# Altium project Satellite_4U_PEE_V100.PrjPcb (part 3 of 4)

## Sheet 09_eMMC.SchDoc
size 420 x 297 mm; SheetNumber: 18; SheetTotal: 33
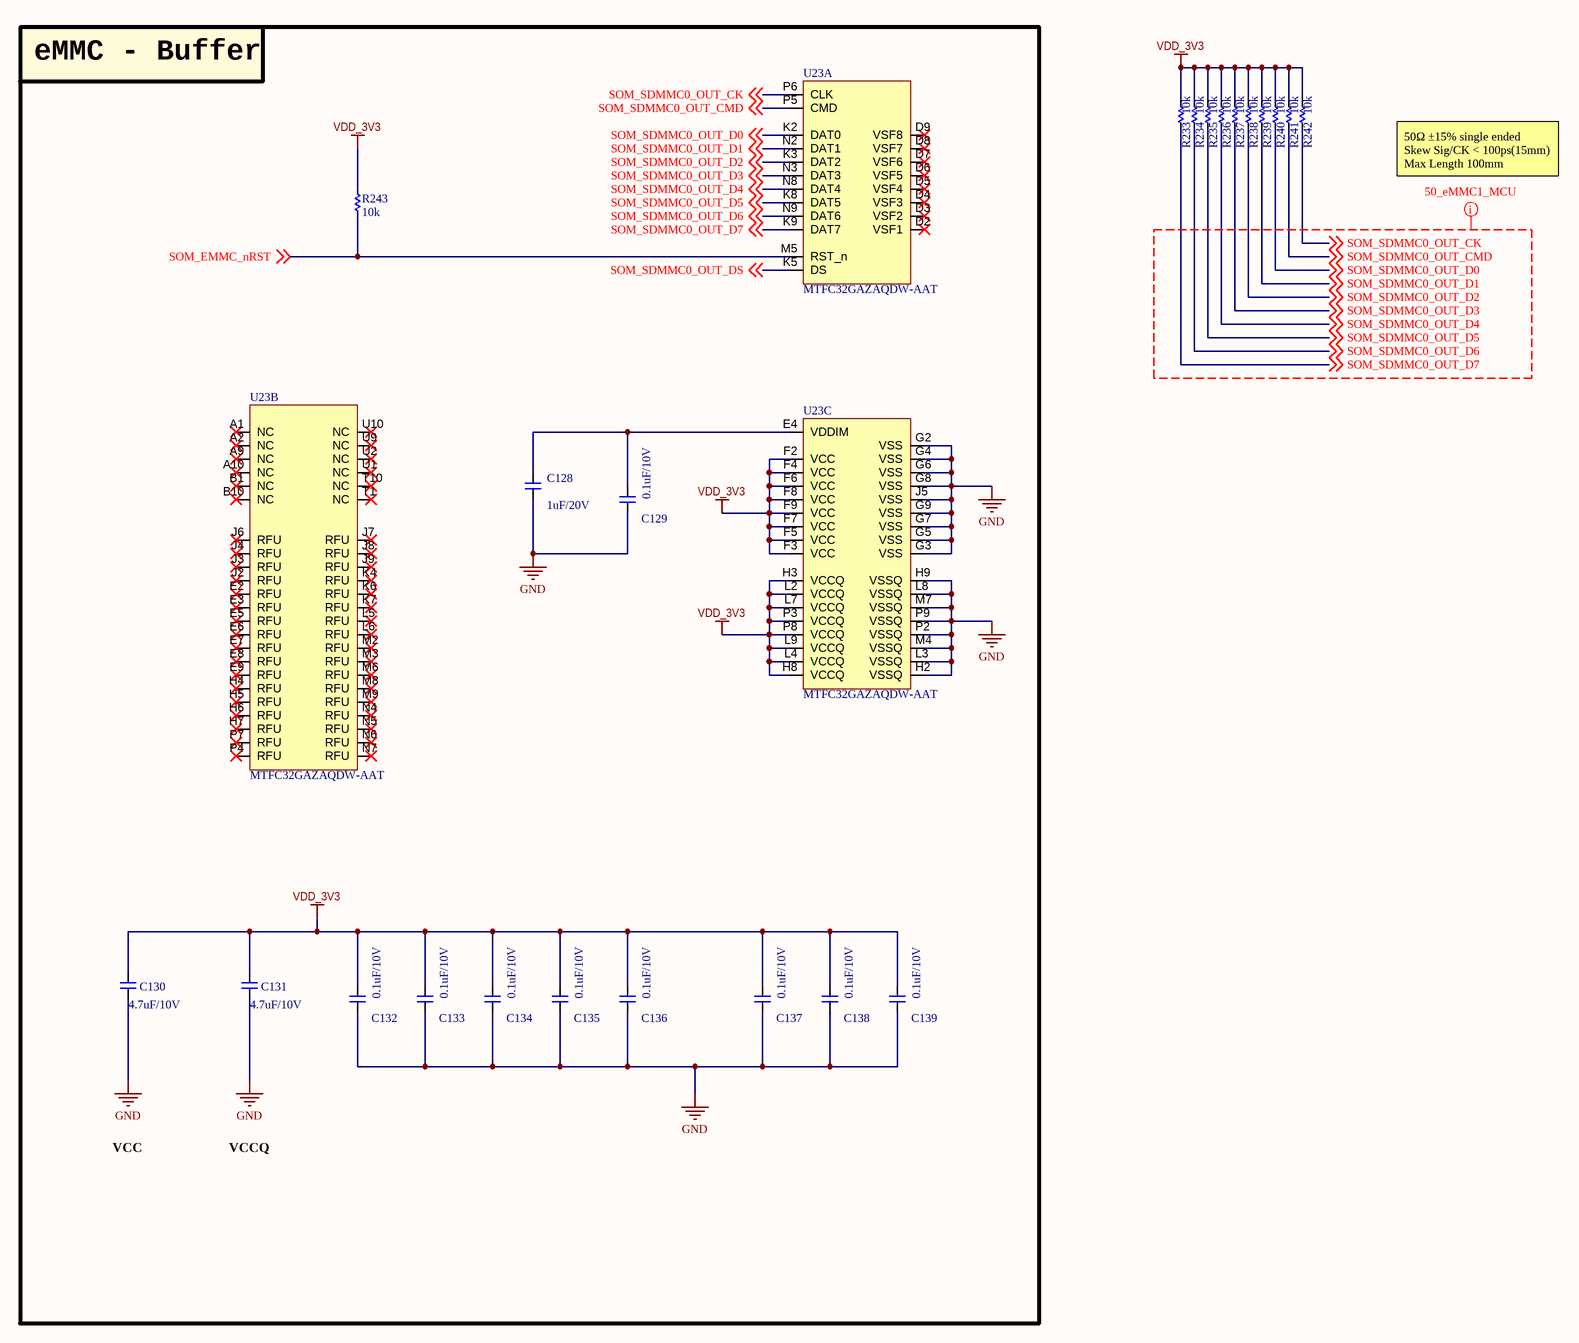
[diagram p19: 09_eMMC.SchDoc]

### Parts
(Parts that share a designator on the sheet are numbered #1, #2 ... from top to bottom, then left to right.)
C128  1uF/20V  [CAP_C_1005X50_L]
C129  0.1uF/10V  [CAP_C_1005X50_L]
C130  4.7uF/10V  [CAP_C_1005X50_L]
C131#2  4.7uF/10V  [CAP_C_1005X50_L]
C132#2  0.1uF/10V  [CAP_C_1005X50_L]
C133#2  0.1uF/10V  [CAP_C_1005X50_L]
C134#2  0.1uF/10V  [CAP_C_1005X50_L]
C135#2  0.1uF/10V  [CAP_C_1005X50_L]
C136#2  0.1uF/10V  [CAP_C_1005X50_L]
C137#2  0.1uF/10V  [CAP_C_1005X50_L]
C138#2  0.1uF/10V  [CAP_C_1005X50_L]
C139#2  0.1uF/10V  [CAP_C_1005X50_L]
R233  10k  [RES_C_1005x30_L]
R234  10k  [RES_C_1005x30_L]
R235  10k  [RES_C_1005x30_L]
R236  10k  [RES_C_1005x30_L]
R237  10k  [RES_C_1005x30_L]
R238  10k  [RES_C_1005x30_L]
R239  10k  [RES_C_1005x30_L]
R240  10k  [RES_C_1005x30_L]
R241  10k  [RES_C_1005x30_L]
R242  10k  [RES_C_1005x30_L]
R243  10k  [RES_C_1005x30_L]
U23#2  MTFC32GAZAQDW-AAT  [BGA_100_C_100P_10X17_1400X1800X150]  (parts A,B,C of 3)

### Blocks framed on the sheet
eMMC - Buffer: C128-C130 C131#2 C132#2 C133#2 C134#2 C135#2 C136#2 C137#2 C138#2 C139#2 R243 U23#2

### Nets
GND: C128.1 C129.1 C130.1 C131#2.1 C132#2.1 C133#2.1 C134#2.1 C135#2.1 C136#2.1 C137#2.1 C138#2.1 C139#2.1 U23#2.G2(VSS) U23#2.G3(VSS) U23#2.G4(VSS) U23#2.G5(VSS) U23#2.G6(VSS) U23#2.G7(VSS) U23#2.G8(VSS) U23#2.G9(VSS) U23#2.H2(VSSQ) U23#2.H9(VSSQ) U23#2.J5(VSS) U23#2.L3(VSSQ) U23#2.L8(VSSQ) U23#2.M4(VSSQ) U23#2.M7(VSSQ) U23#2.P2(VSSQ) U23#2.P9(VSSQ)
VDD_3V3: C130.2 C131#2.2 C132#2.2 C133#2.2 C134#2.2 C135#2.2 C136#2.2 C137#2.2 C138#2.2 C139#2.2 R233.2 R234.2 R235.2 R236.2 R237.2 R238.2 R239.2 R240.2 R241.2 R242.2 R243.2 U23#2.F2(VCC) U23#2.F3(VCC) U23#2.F4(VCC) U23#2.F5(VCC) U23#2.F6(VCC) U23#2.F7(VCC) U23#2.F8(VCC) U23#2.F9(VCC) U23#2.H3(VCCQ) U23#2.H8(VCCQ) U23#2.L2(VCCQ) U23#2.L4(VCCQ) U23#2.L7(VCCQ) U23#2.L9(VCCQ) U23#2.P3(VCCQ) U23#2.P8(VCCQ)
SOM_EMMC_nRST: R243.1 U23#2.M5(RST_n) ; off-sheet SOM_EMMC_nRST
SOM_SDMMC0_OUT_CK: R242.1 U23#2.P6(CLK) ; off-sheet SOM_SDMMC0_OUT_CK
SOM_SDMMC0_OUT_CMD: R241.1 U23#2.P5(CMD) ; off-sheet SOM_SDMMC0_OUT_CMD
SOM_SDMMC0_OUT_D0: R240.1 U23#2.K2(DAT0) ; off-sheet SOM_SDMMC0_OUT_D0
SOM_SDMMC0_OUT_D1: R239.1 U23#2.N2(DAT1) ; off-sheet SOM_SDMMC0_OUT_D1
SOM_SDMMC0_OUT_D2: R238.1 U23#2.K3(DAT2) ; off-sheet SOM_SDMMC0_OUT_D2
SOM_SDMMC0_OUT_D3: R237.1 U23#2.N3(DAT3) ; off-sheet SOM_SDMMC0_OUT_D3
SOM_SDMMC0_OUT_D4: R236.1 U23#2.N8(DAT4) ; off-sheet SOM_SDMMC0_OUT_D4
SOM_SDMMC0_OUT_D5: R235.1 U23#2.K8(DAT5) ; off-sheet SOM_SDMMC0_OUT_D5
SOM_SDMMC0_OUT_D6: R234.1 U23#2.N9(DAT6) ; off-sheet SOM_SDMMC0_OUT_D6
SOM_SDMMC0_OUT_D7: R233.1 U23#2.K9(DAT7) ; off-sheet SOM_SDMMC0_OUT_D7
SOM_SDMMC0_OUT_DS: U23#2.K5(DS) ; off-sheet SOM_SDMMC0_OUT_DS
NetC128_2: C128.2 C129.2 U23#2.E4(VDDIM)

Not connected (* = marked no-connect by the designer): U23#2 A1(NC)* A2(NC)* A9(NC)* A10(NC)* B1(NC)* B10(NC)* D2(VSF1)* D3(VSF2)* D4(VSF3)* D5(VSF4)* D6(VSF5)* D7(VSF6)* D8(VSF7)* D9(VSF8)* E2(RFU)* E3(RFU)* E5(RFU)* E6(RFU)* E7(RFU)* E8(RFU)* E9(RFU)* H4(RFU)* H5(RFU)* H6(RFU)* H7(RFU)* J2(RFU)* J3(RFU)* J4(RFU)* J6(RFU)* J7(RFU)* J8(RFU)* J9(RFU)* K4(RFU)* K6(RFU)* K7(RFU)* L5(RFU)* L6(RFU)* M2(RFU)* M3(RFU)* M6(RFU)* M8(RFU)* M9(RFU)* N4(RFU)* N5(RFU)* N6(RFU)* N7(RFU)* P4(RFU)* P7(RFU)* T1(NC)* T10(NC)* U1(NC)* U2(NC)* U9(NC)* U10(NC)*

### Layout directives
net class 50_eMMC1_MCU: SOM_SDMMC0_OUT_CK, SOM_SDMMC0_OUT_CMD, SOM_SDMMC0_OUT_D0, SOM_SDMMC0_OUT_D1, SOM_SDMMC0_OUT_D2, SOM_SDMMC0_OUT_D3, SOM_SDMMC0_OUT_D4, SOM_SDMMC0_OUT_D5, SOM_SDMMC0_OUT_D6, SOM_SDMMC0_OUT_D7

### Notes on the sheet
- 50Ω ±15% single ended
  Skew Sig/CK < 100ps(15mm)
  Max Length 100mm
- VCC
- VCCQ
- Project:
- BEE-1012
- Sub-system:
- SATELLITE_EXP_CONTROLLER
- Design by:
- SANG HUYNH
- BAO BUI
- Sheet title:
- Sheet
- A3
- of
- Checked by:
- Approved by:
- VU PHAM
- Revision:
- Document No:
- Size:
- Date:

### Library data of the parts
C128-C130 C131#2 C132#2 C133#2 C134#2 C135#2 C136#2 C137#2 C138#2 C139#2 = _CAP_C_2: CAP
R233-R243 = _RES_B_2: RES

## Sheet 10_USB.SchDoc
size 420 x 297 mm; SheetNumber: 19; SheetTotal: 33
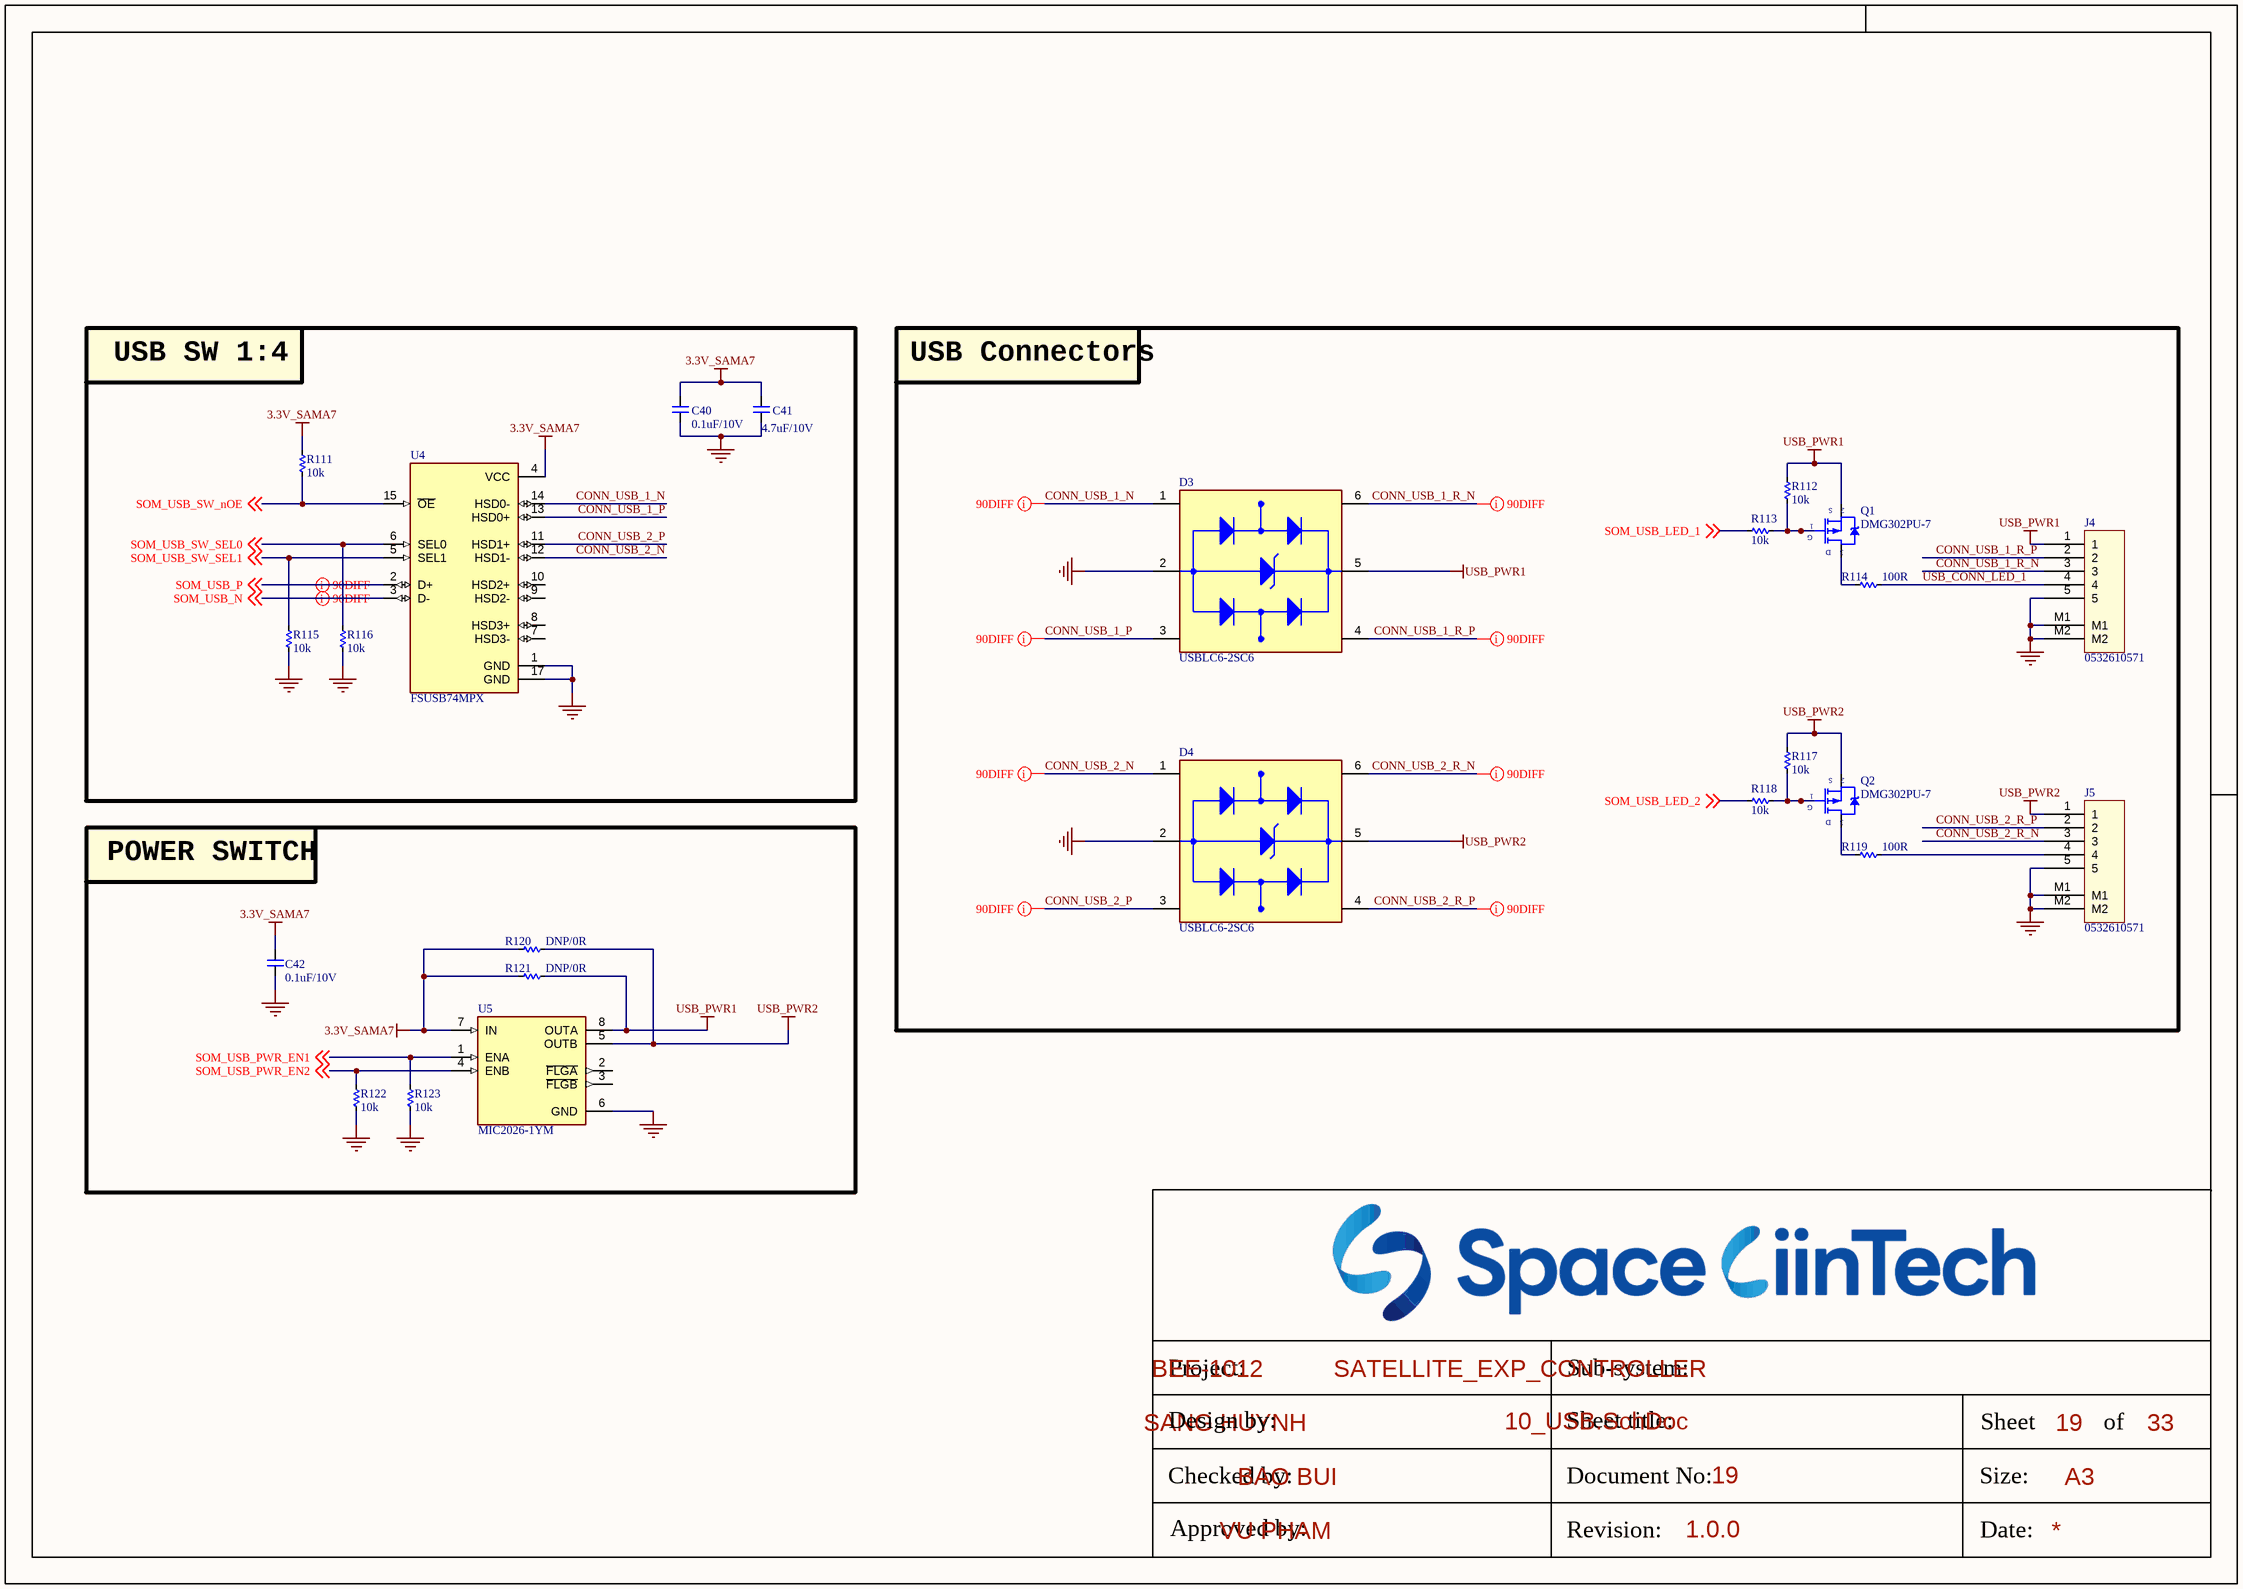
[diagram p20: 10_USB.SchDoc]

### Parts
C40  0.1uF/10V  [CAP_C_1005X50_L]
C41  4.7uF/10V  [CAP_C_1005X50_L]
C42  0.1uF/10V  [CAP_C_1005X50_L]
D3  USBLC6-2SC6  [SOT95P280X145-6N]
D4  USBLC6-2SC6  [SOT95P280X145-6N]
J4  0532610571  [MOLEX_0532610571]
J5  0532610571  [MOLEX_0532610571]
Q1  DMG302PU-7  [SOT95P240X120-3N]
Q2  DMG302PU-7  [SOT95P240X120-3N]
R111  10k  [RES_C_1005x30_L]
R112  10k  [RES_C_1005x30_L]
R113  10k  [RES_C_1005x30_L]
R114  100R  [RES_C_1005x30_L]
R115  10k  [RES_C_1005x30_L]
R116  10k  [RES_C_1005x30_L]
R117  10k  [RES_C_1005x30_L]
R118  10k  [RES_C_1005x30_L]
R119  100R  [RES_C_1005x30_L]
R120  DNP/0R  [RES_C_1005x30_L]
R121  DNP/0R  [RES_C_1005x30_L]
R122  10k  [RES_C_1005x30_L]
R123  10k  [RES_C_1005x30_L]
U4  FSUSB74MPX  [QFN50P300X300X80-17N]
U5  MIC2026-1YM  [SOIC127P602X173-8N]

### Blocks framed on the sheet
USB SW 1:4: C40 C41 R111 R115 R116 U4
USB Connectors: D3 D4 J4 J5 Q1 Q2 R112-R114 R117-R119
POWER SWITCH: C42 R120-R123 U5

### Nets
3.3V_SAMA7: C40.2 C41.2 C42.2 R111.1 R120.2 R121.2 U4.4(VCC) U5.7(IN)
GND: C40.1 C41.1 C42.1 D3.2(GND) D4.2(GND) J4.5 J4.M1 J4.M2 J5.5 J5.M1 J5.M2 R115.2 R116.2 R122.2 R123.2 U4.1(GND) U4.17(GND) U5.6(GND)
USB_PWR1: D3.5(VBUS) J4.1 Q1.2(S) R112.1 R121.1 U5.8(OUTA)
USB_PWR2: D4.5(VBUS) J5.1 Q2.2(S) R117.1 R120.1 U5.5(OUTB)
CONN_USB_1_N: D3.1(I/O1_IN) U4.14(HSD0-)
CONN_USB_1_P: D3.3(I/O2_IN) U4.13(HSD0+)
CONN_USB_1_R_N: D3.6(I/O1_OUT) J4.3
CONN_USB_1_R_P: D3.4(I/O2_OUT) J4.2
CONN_USB_2_N: D4.1(I/O1_IN) U4.12(HSD1-)
CONN_USB_2_P: D4.3(I/O2_IN) U4.11(HSD1+)
CONN_USB_2_R_N: D4.6(I/O1_OUT) J5.3
CONN_USB_2_R_P: D4.4(I/O2_OUT) J5.2
SOM_USB_LED_1: R113.1 ; off-sheet SOM_USB_LED_1
SOM_USB_LED_2: R118.1 ; off-sheet SOM_USB_LED_2
SOM_USB_N: U4.3(D-) ; off-sheet SOM_USB_N  [project net USBC_N]
SOM_USB_P: U4.2(D+) ; off-sheet SOM_USB_P  [project net USBC_P]
SOM_USB_PWR_EN1: R123.1 U5.1(ENA) ; off-sheet SOM_USB_PWR_EN1
SOM_USB_PWR_EN2: R122.1 U5.4(ENB) ; off-sheet SOM_USB_PWR_EN2
SOM_USB_SW_nOE: R111.2 U4.15(~{OE}) ; off-sheet SOM_USB_SW_nOE
SOM_USB_SW_SEL0: R116.1 U4.6(SEL0) ; off-sheet SOM_USB_SW_SEL0
SOM_USB_SW_SEL1: R115.1 U4.5(SEL1) ; off-sheet SOM_USB_SW_SEL1
USB_CONN_LED_1: J4.4 R114.2
NetJ5_4: J5.4 R119.2
NetQ1_1: Q1.1(G) R112.2 R113.2
NetQ1_3: Q1.3(D) R114.1
NetQ2_1: Q2.1(G) R117.2 R118.2
NetQ2_3: Q2.3(D) R119.1

Not connected (* = marked no-connect by the designer): U4 7(HSD3-) 8(HSD3+) 9(HSD2-) 10(HSD2+); U5 2(~{FLGA}) 3(~{FLGB})

### Layout directives
differential pair; differential pair class DIFF90: CONN_USB_1_N, CONN_USB_1_P, CONN_USB_1_R_N, CONN_USB_1_R_P, CONN_USB_2_N, CONN_USB_2_P, CONN_USB_2_R_N, CONN_USB_2_R_P, USBC_N, USBC_P

### Notes on the sheet
- Project:
- BEE-1012
- Sub-system:
- SATELLITE_EXP_CONTROLLER
- Design by:
- SANG HUYNH
- BAO BUI
- Sheet title:
- Sheet
- A3
- of
- Checked by:
- Approved by:
- VU PHAM
- Revision:
- Document No:
- Size:
- Date:

### Library data of the parts
C40-C42 = _CAP_C_2: CAP
D3 D4 = USBLC6-2SC6: 17V Clamp 5A (8/20Âµs) Ipp Tvs Diode Surface Mount SOT-23-6; MF: STMicroelectronics; Value: *; SnapEDA_Link: https://www.snapeda.com/parts/USBLC6-2SC6/STMicroelectronics/view-part/?ref=snap; Check_prices: https://www.snapeda.com/parts/USBLC6-2SC6/STMicroelectronics/view-part/?ref=eda; Purchase-URL: https://pricing.snapeda.com/search/part/USBLC6-2SC6/?ref=eda; Price: None; Availability: In Stock; Package: SOT-23-6 STMicroelectronics; MP: USBLC6-2SC6
J4 J5 = Header 5x1_2M
Q1 Q2 = MOSFET_P_GSD
R111-R123 = _RES_B_2: RES
U4 = IC_USB_SW_FSUSB74MPX: USB Switch IC 1 Channel 16-MLP (3x3); MF: ON Semiconductor; SnapEDA_Link: https://www.snapeda.com/parts/FSUSB74MPX/Onsemi/view-part/?ref=snap; Package: WQFN-16 ON Semiconductor; Value: *; MP: FSUSB74MPX; Check_prices: https://www.snapeda.com/parts/FSUSB74MPX/Onsemi/view-part/?ref=eda
U5 = IC_PWRSW_MIC2026-1YM: Power Switch/Driver 1:2 N-Channel 1.25A 8-SOIC; MF: Microchip; SnapEDA_Link: https://www.snapeda.com/parts/MIC2026-1YM/Microchip/view-part/?ref=snap; Package: SO-8 Microchip; Value: *; MP: MIC2026-1YM; Check_prices: https://www.snapeda.com/parts/MIC2026-1YM/Microchip/view-part/?ref=eda

## Sheet 11_MCU.SchDoc
size 420 x 297 mm; SheetNumber: 20; SheetTotal: 33
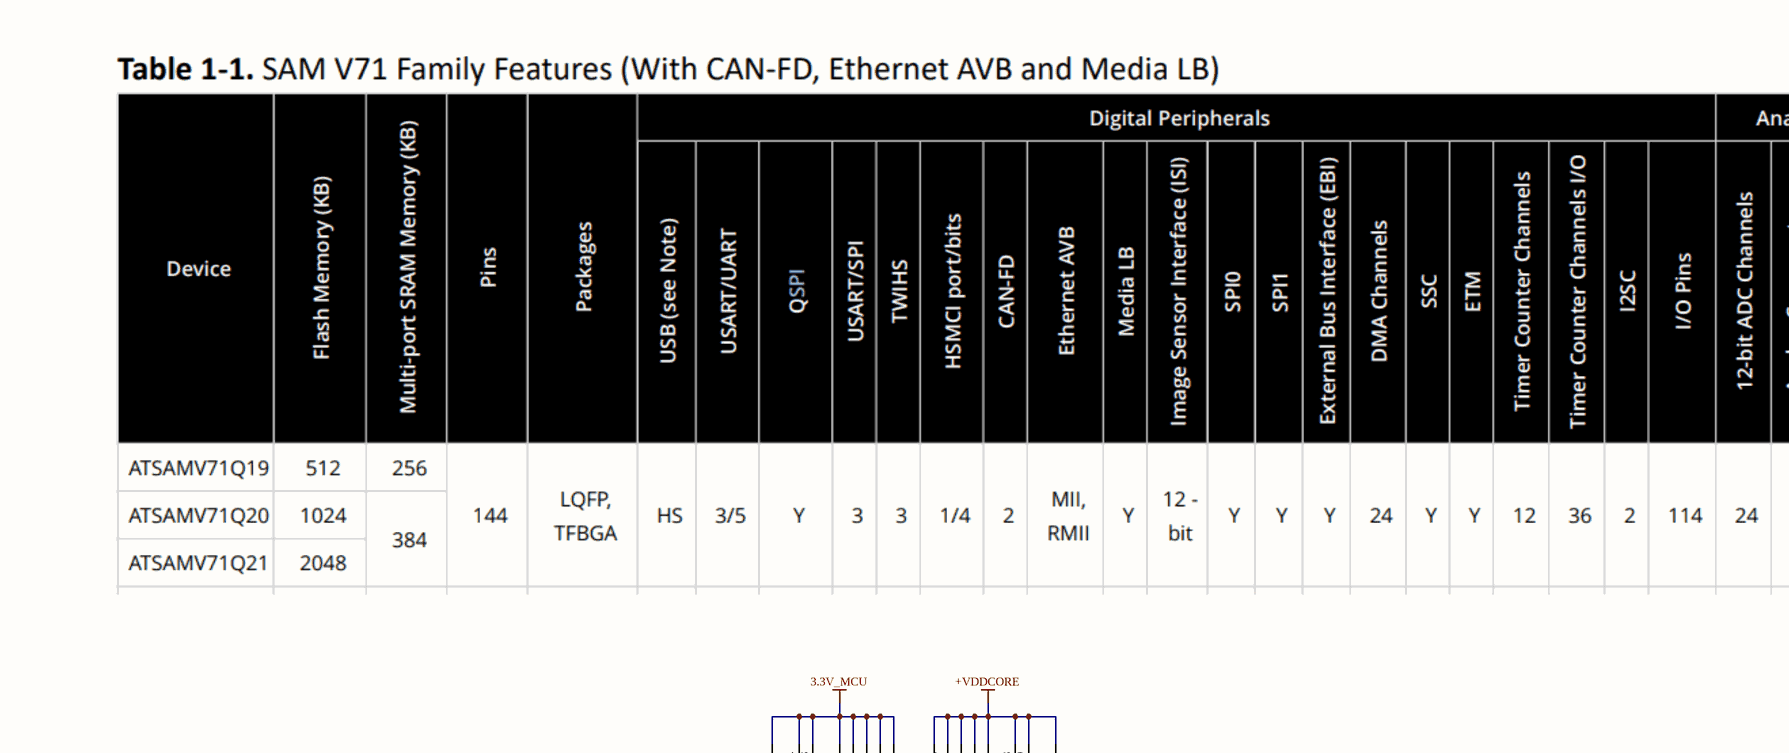
[diagram p21: 11_MCU.SchDoc, top left]
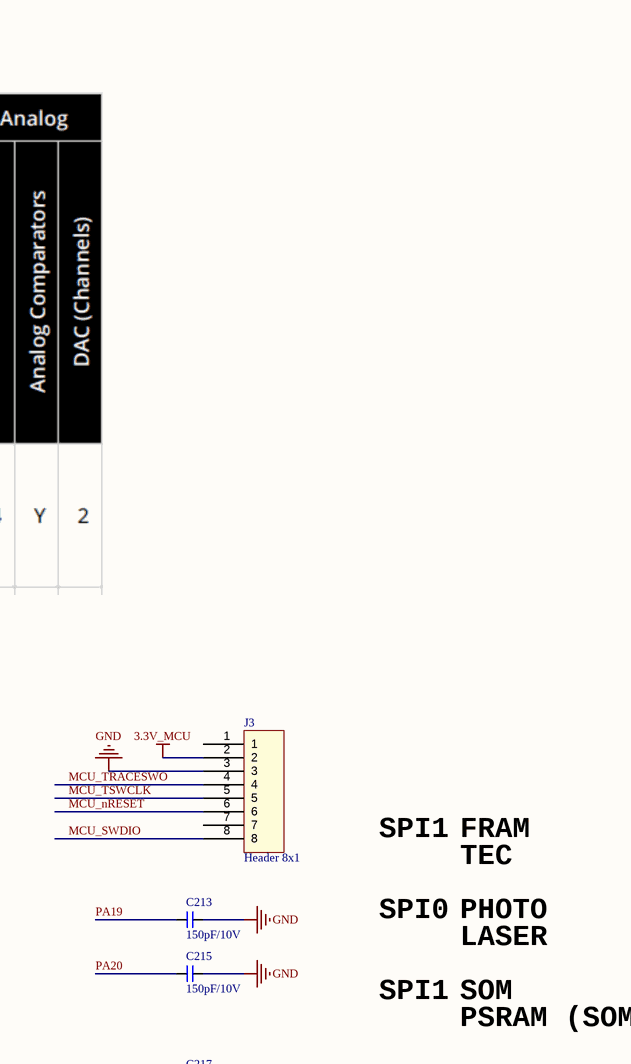
[diagram p22: 11_MCU.SchDoc, top right]
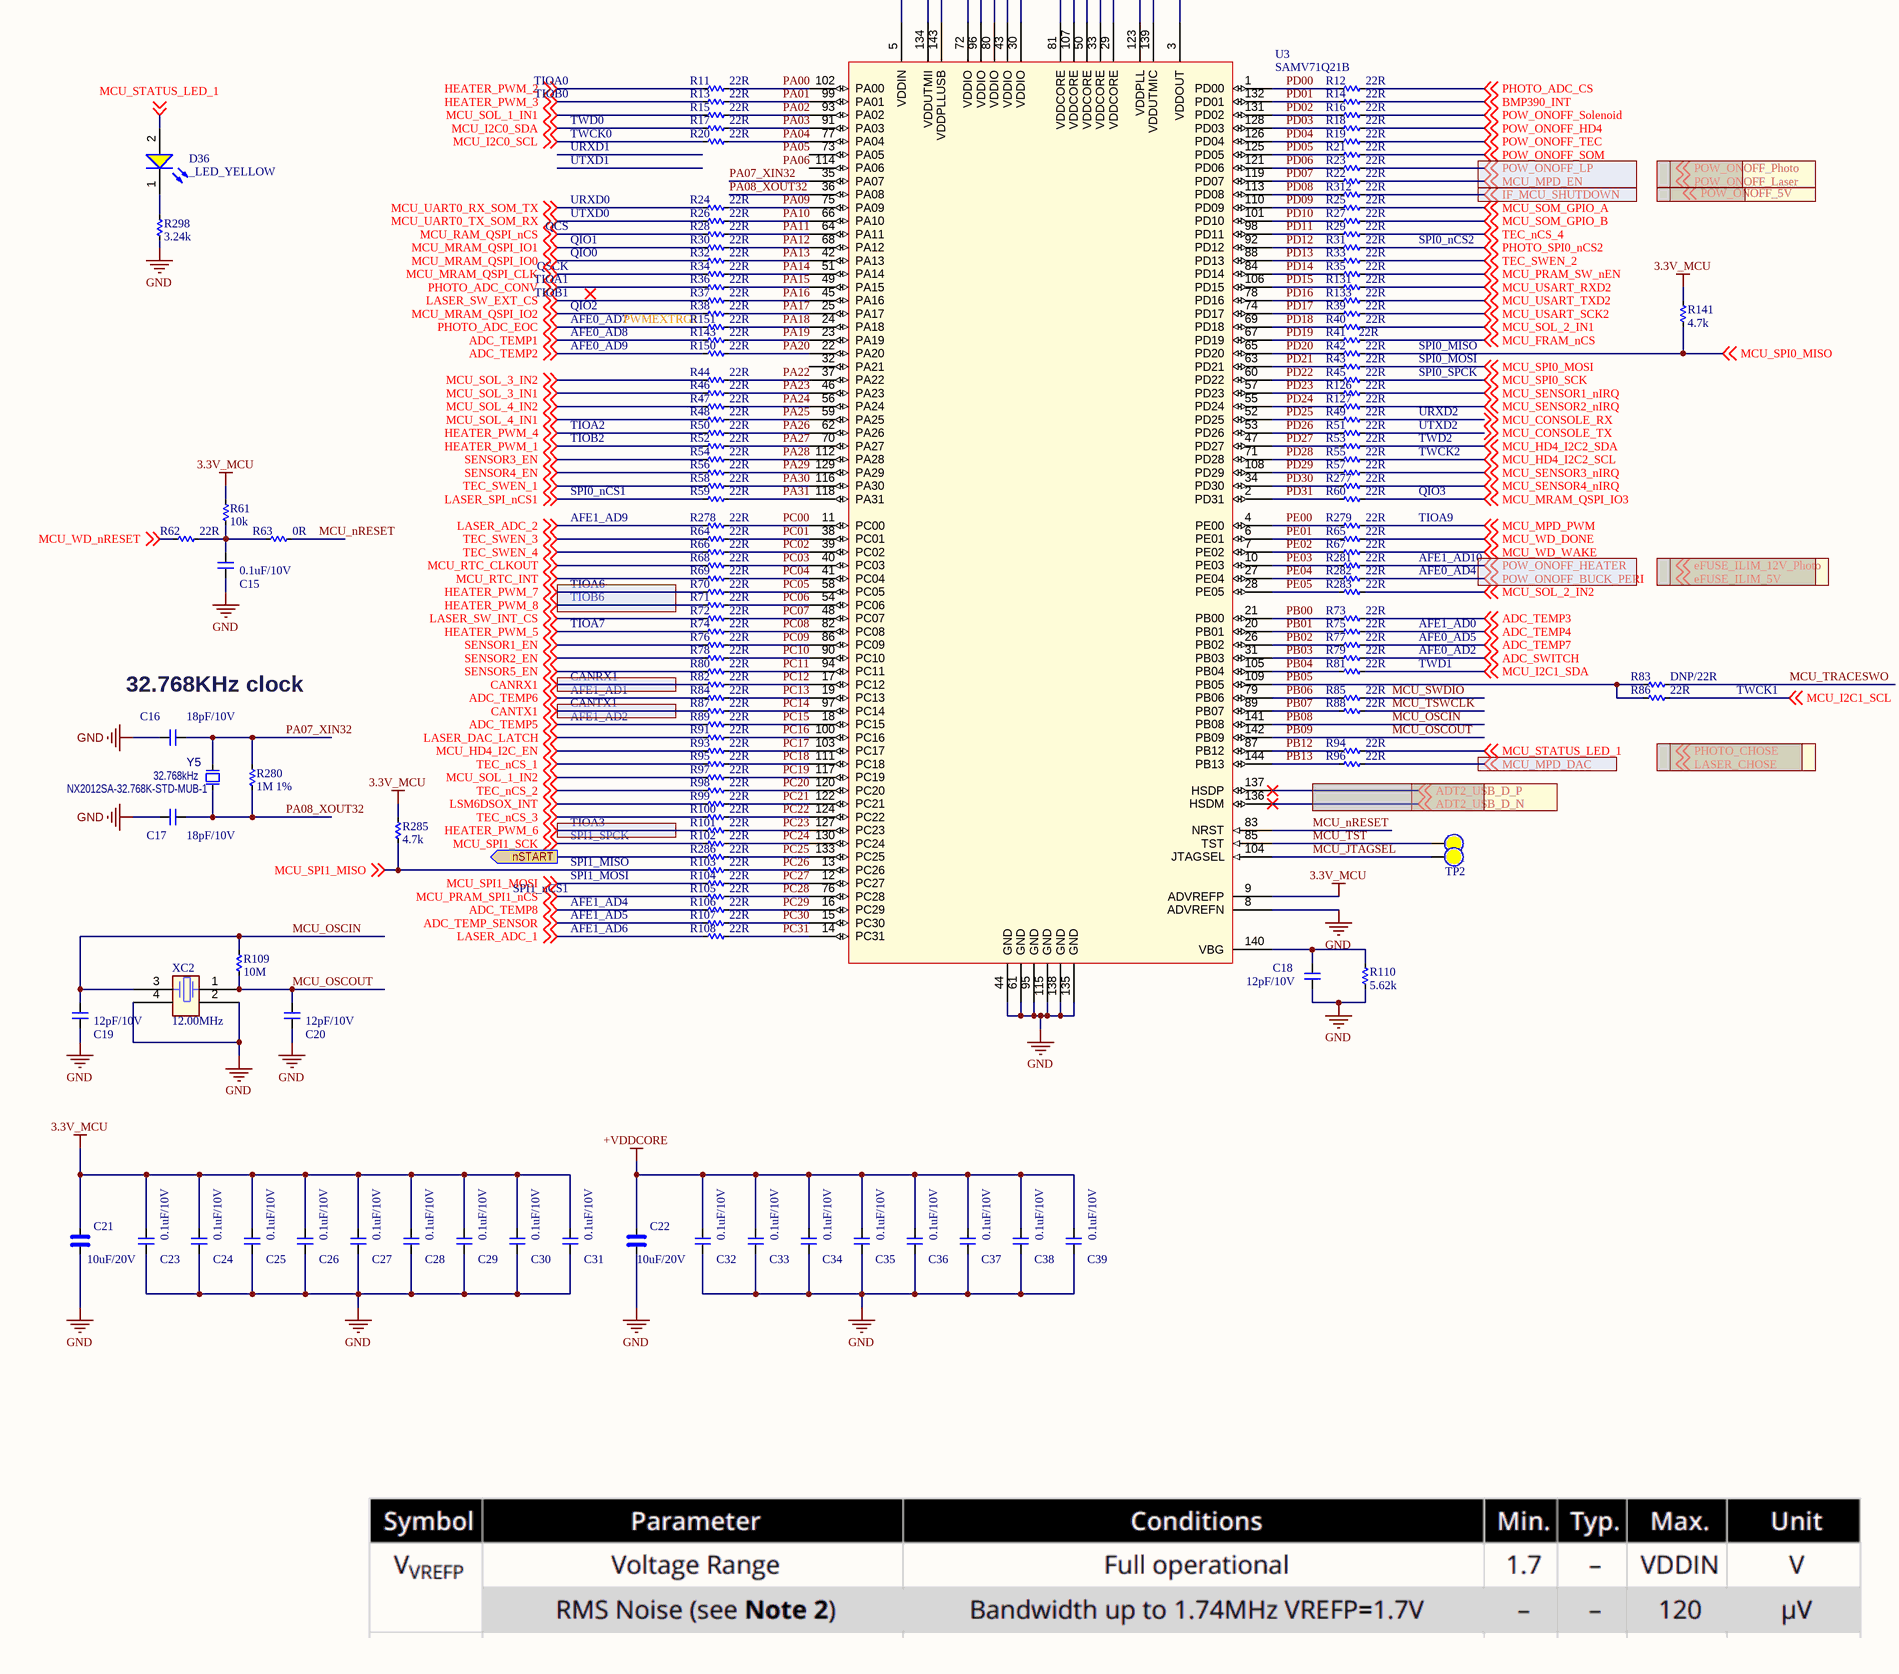
[diagram p23: 11_MCU.SchDoc, bottom left]
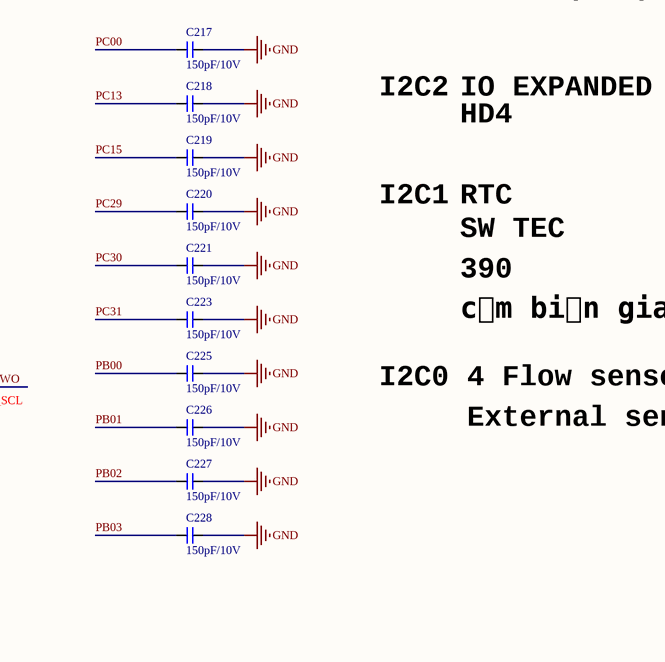
[diagram p24: 11_MCU.SchDoc, bottom right]

### Parts
C15  0.1uF/10V  [CAP_C_1005X50_L]
C16  18pF/10V  [CAP_C_0603x30]
C17  18pF/10V  [CAP_C_0603x30]
C18  12pF/10V  [CAP_C_1005X50_L]
C19  12pF/10V  [CAP_C_1005X50_L]
C20  12pF/10V  [CAP_C_1005X50_L]
C21  10uF/20V  [CAP_C_2012X110]
C22  10uF/20V  [CAP_C_2012X110]
C23  0.1uF/10V  [CAP_C_1005X50_L]
C24  0.1uF/10V  [CAP_C_1005X50_L]
C25  0.1uF/10V  [CAP_C_1005X50_L]
C26  0.1uF/10V  [CAP_C_1005X50_L]
C27  0.1uF/10V  [CAP_C_1005X50_L]
C28  0.1uF/10V  [CAP_C_1005X50_L]
C29  0.1uF/10V  [CAP_C_1005X50_L]
C30  0.1uF/10V  [CAP_C_1005X50_L]
C31  0.1uF/10V  [CAP_C_1005X50_L]
C32  0.1uF/10V  [CAP_C_1005X50_L]
C33  0.1uF/10V  [CAP_C_1005X50_L]
C34  0.1uF/10V  [CAP_C_1005X50_L]
C35  0.1uF/10V  [CAP_C_1005X50_L]
C36  0.1uF/10V  [CAP_C_1005X50_L]
C37  0.1uF/10V  [CAP_C_1005X50_L]
C38  0.1uF/10V  [CAP_C_1005X50_L]
C39  0.1uF/10V  [CAP_C_1005X50_L]
C213  150pF/10V  [CAP_C_0603x30]
C215  150pF/10V  [CAP_C_0603x30]
C217  150pF/10V  [CAP_C_0603x30]
C218  150pF/10V  [CAP_C_0603x30]
C219  150pF/10V  [CAP_C_0603x30]
C220  150pF/10V  [CAP_C_0603x30]
C221  150pF/10V  [CAP_C_0603x30]
C223  150pF/10V  [CAP_C_0603x30]
C225  150pF/10V  [CAP_C_0603x30]
C226  150pF/10V  [CAP_C_0603x30]
C227  150pF/10V  [CAP_C_0603x30]
C228  150pF/10V  [CAP_C_0603x30]
D36  _LED_YELLOW  [LED_0402]
J3  Header 8x1  [SAMTEC_TSM-108-01-L-SV-P-TR]
R11  22R  [RES_C_0603X30]
R12  22R  [RES_C_0603X30]
R13  22R  [RES_C_0603X30]
R14  22R  [RES_C_0603X30]
R15  22R  [RES_C_0603X30]
R16  22R  [RES_C_0603X30]
R17  22R  [RES_C_0603X30]
R18  22R  [RES_C_0603X30]
R19  22R  [RES_C_0603X30]
R20  22R  [RES_C_0603X30]
R21  22R  [RES_C_0603X30]
R22  22R  [RES_C_0603X30]
R23  22R  [RES_C_0603X30]
R24  22R  [RES_C_0603X30]
R25  22R  [RES_C_0603X30]
R26  22R  [RES_C_0603X30]
R27  22R  [RES_C_0603X30]
R28  22R  [RES_C_0603X30]
R29  22R  [RES_C_0603X30]
R30  22R  [RES_C_0603X30]
R31  22R  [RES_C_0603X30]
R32  22R  [RES_C_0603X30]
R33  22R  [RES_C_0603X30]
R34  22R  [RES_C_0603X30]
R35  22R  [RES_C_0603X30]
R36  22R  [RES_C_0603X30]
R37  22R  [RES_C_0603X30]
R38  22R  [RES_C_0603X30]
R39  22R  [RES_C_0603X30]
R40  22R  [RES_C_0603X30]
R41  22R  [RES_C_0603X30]
R42  22R  [RES_C_0603X30]
R43  22R  [RES_C_0603X30]
R44  22R  [RES_C_0603X30]
R45  22R  [RES_C_0603X30]
R46  22R  [RES_C_0603X30]
R47  22R  [RES_C_0603X30]
R48  22R  [RES_C_0603X30]
R49  22R  [RES_C_0603X30]
R50  22R  [RES_C_0603X30]
R51  22R  [RES_C_0603X30]
R52  22R  [RES_C_0603X30]
R53  22R  [RES_C_0603X30]
R54  22R  [RES_C_0603X30]
R55  22R  [RES_C_0603X30]
R56  22R  [RES_C_0603X30]
R57  22R  [RES_C_0603X30]
R58  22R  [RES_C_0603X30]
R59  22R  [RES_C_0603X30]
R60  22R  [RES_C_0603X30]
R61  10k  [RES_C_1005x30_L]
R62  22R  [RES_C_1005x30_L]
R63  0R  [RES_C_0603X30]
R64  22R  [RES_C_0603X30]
R65  22R  [RES_C_0603X30]
R66  22R  [RES_C_0603X30]
R67  22R  [RES_C_0603X30]
R68  22R  [RES_C_0603X30]
R69  22R  [RES_C_0603X30]
R70  22R  [RES_C_0603X30]
R71  22R  [RES_C_0603X30]
R72  22R  [RES_C_0603X30]
R73  22R  [RES_C_0603X30]
R74  22R  [RES_C_0603X30]
R75  22R  [RES_C_0603X30]
R76  22R  [RES_C_0603X30]
R77  22R  [RES_C_0603X30]
R78  22R  [RES_C_0603X30]
R79  22R  [RES_C_0603X30]
R80  22R  [RES_C_0603X30]
R81  22R  [RES_C_0603X30]
R82  22R  [RES_C_0603X30]
R83  DNP/22R  [RES_C_0603X30]
R84  22R  [RES_C_0603X30]
R85  22R  [RES_C_0603X30]
R86  22R  [RES_C_0603X30]
R87  22R  [RES_C_0603X30]
R88  22R  [RES_C_0603X30]
R89  22R  [RES_C_0603X30]
R91  22R  [RES_C_0603X30]
R93  22R  [RES_C_0603X30]
R94  22R  [RES_C_0603X30]
R95  22R  [RES_C_0603X30]
R96  22R  [RES_C_0603X30]
R97  22R  [RES_C_0603X30]
R98  22R  [RES_C_0603X30]
R99  22R  [RES_C_0603X30]
R100  22R  [RES_C_0603X30]
R101  22R  [RES_C_0603X30]
R102  22R  [RES_C_0603X30]
R103  22R  [RES_C_0603X30]
R104  22R  [RES_C_0603X30]
R105  22R  [RES_C_0603X30]
R106  22R  [RES_C_0603X30]
R107  22R  [RES_C_0603X30]
R108  22R  [RES_C_0603X30]
R109  10M  [RES_C_1005x30_L]
R110  5.62k  [RES_C_1005x30_L]
R126  22R  [RES_C_0603X30]
R127  22R  [RES_C_0603X30]
R131  22R  [RES_C_0603X30]
R133  22R  [RES_C_0603X30]
R141  4.7k  [RES_C_0603X30]
R143  22R  [RES_C_0603X30]
R150  22R  [RES_C_0603X30]
R151  22R  [RES_C_0603X30]
R277  22R  [RES_C_0603X30]
R278  22R  [RES_C_0603X30]
R279  22R  [RES_C_0603X30]
R280  1M 1%  [RES_C_1005x30_L]
R281  22R  [RES_C_0603X30]
R282  22R  [RES_C_0603X30]
R283  22R  [RES_C_0603X30]
R285  4.7k  [RES_C_0603X30]
R286  22R  [RES_C_0603X30]
R298  3.24k  [RES_C_1005x30_L]
R312  22R  [RES_C_0603X30]
TP1  (no value)  [TP_1mm_SMD]  (no BOM)
TP2  (no value)  [TP_1mm_SMD]  (no BOM)
U3  SAMV71Q21B  [AP6-00118]
XC2  value 12.00MHz  [AP7-00039]  (hidden comment: FC5BQCCMC12.0-T1)
Y5  value 32.768kHz  Manufacturer Part Number 1: NX2012SA-32.768K-STD-MUB-1  [CRYSTAL_NX2012SA]  (hidden comment: Crystal 2 Pins)

### Ports
nSTART (out)

### Nets
3.3V_MCU: C21.1 C23.2 C24.2 C25.2 C26.2 C27.2 C28.2 C29.2 C30.2 C31.2 J3.2 R61.2 R141.1 R285.1 U3.5(VDDIN) U3.9(ADVREFP) U3.30(VDDIO) U3.43(VDDIO) U3.72(VDDIO) U3.80(VDDIO) U3.96(VDDIO) U3.134(VDDUTMII) U3.143(VDDPLLUSB)
+VDDCORE: C22.1 C32.2 C33.2 C34.2 C35.2 C36.2 C37.2 C38.2 C39.2 U3.3(VDDOUT) U3.29(VDDCORE) U3.33(VDDCORE) U3.50(VDDCORE) U3.81(VDDCORE) U3.107(VDDCORE) U3.123(VDDPLL) U3.139(VDDUTMIC)
GND: C15.1 C16.2 C17.2 C18.1 C19.1 C20.1 C21.2 C22.2 C23.1 C24.1 C25.1 C26.1 C27.1 C28.1 C29.1 C30.1 C31.1 C32.1 C33.1 C34.1 C35.1 C36.1 C37.1 C38.1 C39.1 C213.1 C215.1 C217.1 C218.1 C219.1 C220.1 C221.1 C223.1 C225.1 C226.1 C227.1 C228.1 J3.3 R110.1 R298.2 U3.8(ADVREFN) U3.44(GND) U3.61(GND) U3.95(GND) U3.115(GND) U3.135(GND) U3.138(GND) XC2.2 XC2.4
ADC_SWITCH: R79.1 ; off-sheet ADC_SWITCH
ADC_TEMP1: R143.2 ; off-sheet ADC_TEMP1
ADC_TEMP2: R150.2 ; off-sheet ADC_TEMP2
ADC_TEMP3: R73.1 ; off-sheet ADC_TEMP3
ADC_TEMP4: R75.1 ; off-sheet ADC_TEMP4
ADC_TEMP5: R89.2 ; off-sheet ADC_TEMP5
ADC_TEMP6: R84.2 ; off-sheet ADC_TEMP6
ADC_TEMP7: R77.1 ; off-sheet ADC_TEMP7
ADC_TEMP8: R106.2 ; off-sheet ADC_TEMP8
ADC_TEMP_SENSOR: R107.2 ; off-sheet ADC_TEMP_SENSOR  [project net TEMP _SENSOR]
BMP390_INT: R14.1 ; off-sheet BMP390_INT
CANRX1: R82.2 ; off-sheet CANRX1
CANTX1: R87.2 ; off-sheet CANTX1
HEATER_PWM_1: R52.2 ; off-sheet HEATER_PWM_1
HEATER_PWM_2: R11.2 ; off-sheet HEATER_PWM_2
HEATER_PWM_3: R13.2 ; off-sheet HEATER_PWM_3
HEATER_PWM_4: R50.2 ; off-sheet HEATER_PWM_4
HEATER_PWM_5: R74.2 ; off-sheet HEATER_PWM_5
HEATER_PWM_6: R101.2 ; off-sheet HEATER_PWM_6
HEATER_PWM_7: R70.2 ; off-sheet HEATER_PWM_7
HEATER_PWM_8: R71.2 ; off-sheet HEATER_PWM_8
IF_MCU_SHUTDOWN: R312.1 ; off-sheet IF_MCU_SHUTDOWN
LASER_ADC_1: R108.2 ; off-sheet LASER_ADC_1
LASER_ADC_2: R278.2 ; off-sheet LASER_ADC_2
LASER_DAC_LATCH: R91.2 ; off-sheet LASER_DAC_LATCH
LASER_SPI_nCS1: R59.2 ; off-sheet LASER_SPI_nCS1
LASER_SW_EXT_CS: R37.2 ; off-sheet LASER_SW_EXT_CS
LASER_SW_INT_CS: R72.2 ; off-sheet LASER_SW_INT_CS
LSM6DSOX_INT: R99.2 ; off-sheet LSM6DSOX_INT
MCU_CONSOLE_RX: R49.1 ; off-sheet MCU_CONSOLE_RX
MCU_CONSOLE_TX: R51.1 ; off-sheet MCU_CONSOLE_TX
MCU_FRAM_nCS: R41.2 ; off-sheet MCU_FRAM_nCS
MCU_HD4_I2C2_SCL: R55.1 ; off-sheet MCU_HD4_I2C2_SCL
MCU_HD4_I2C2_SDA: R53.1 ; off-sheet MCU_HD4_I2C2_SDA
MCU_HD4_I2C_EN: R93.2 ; off-sheet MCU_HD4_I2C_EN
MCU_I2C0_SCL: R20.2 ; off-sheet MCU_I2C0_SCL
MCU_I2C0_SDA: R17.2 ; off-sheet MCU_I2C0_SDA
MCU_I2C1_SCL: R86.1 ; off-sheet MCU_I2C1_SCL
MCU_I2C1_SDA: R81.1 ; off-sheet MCU_I2C1_SDA
MCU_JTAGSEL: TP2.0 U3.104(JTAGSEL)
MCU_MPD_DAC: R96.1 ; off-sheet MCU_MPD_DAC
MCU_MPD_EN: R22.1 ; off-sheet MCU_MPD_EN
MCU_MPD_PWM: R279.1 ; off-sheet MCU_MPD_PWM
MCU_MRAM_QSPI_CLK: R34.2 ; off-sheet MCU_MRAM_QSPI_CLK
MCU_MRAM_QSPI_IO0: R32.2 ; off-sheet MCU_MRAM_QSPI_IO0
MCU_MRAM_QSPI_IO1: R30.2 ; off-sheet MCU_MRAM_QSPI_IO1
MCU_MRAM_QSPI_IO2: R38.2 ; off-sheet MCU_MRAM_QSPI_IO2
MCU_MRAM_QSPI_IO3: R60.1 ; off-sheet MCU_MRAM_QSPI_IO3
MCU_nRESET: J3.6 R63.1 U3.83(NRST)
MCU_OSCIN: C19.2 R109.2 U3.141(PB08) XC2.3  [also labelled PB08]
MCU_OSCOUT: C20.2 R109.1 U3.142(PB09) XC2.1  [also labelled PB09]
MCU_PRAM_SPI1_nCS: R105.2 ; off-sheet MCU_PRAM_SPI1_nCS
MCU_PRAM_SW_nEN: R35.1 ; off-sheet MCU_PRAM_SW_nEN
MCU_RAM_QSPI_nCS: R28.2 ; off-sheet MCU_RAM_QSPI_nCS
MCU_RTC_CLKOUT: R68.2 ; off-sheet MCU_RTC_CLKOUT
MCU_RTC_INT: R69.2 ; off-sheet MCU_RTC_INT
MCU_SENSOR1_nIRQ: R126.1 ; off-sheet MCU_SENSOR1_nIRQ
MCU_SENSOR2_nIRQ: R127.1 ; off-sheet MCU_SENSOR2_nIRQ
MCU_SENSOR3_nIRQ: R57.2 ; off-sheet MCU_SENSOR3_nIRQ
MCU_SENSOR4_nIRQ: R277.2 ; off-sheet MCU_SENSOR4_nIRQ
MCU_SOL_1_IN1: R15.2 ; off-sheet MCU_SOL_1_IN1
MCU_SOL_1_IN2: R97.2 ; off-sheet MCU_SOL_1_IN2
MCU_SOL_2_IN1: R40.1 ; off-sheet MCU_SOL_2_IN1
MCU_SOL_2_IN2: R283.1 ; off-sheet MCU_SOL_2_IN2
MCU_SOL_3_IN1: R46.2 ; off-sheet MCU_SOL_3_IN1
MCU_SOL_3_IN2: R44.2 ; off-sheet MCU_SOL_3_IN2
MCU_SOL_4_IN1: R48.2 ; off-sheet MCU_SOL_4_IN1
MCU_SOL_4_IN2: R47.2 ; off-sheet MCU_SOL_4_IN2
MCU_SOM_GPIO_A: R25.1 ; off-sheet MCU_SOM_GPIO_A
MCU_SOM_GPIO_B: R27.1 ; off-sheet MCU_SOM_GPIO_B
MCU_SPI0_MISO: R42.1 R141.2 ; off-sheet MCU_SPI0_MISO
MCU_SPI0_MOSI: R43.1 ; off-sheet MCU_SPI0_MOSI
MCU_SPI0_SCK: R45.1 ; off-sheet MCU_SPI0_SCK
MCU_SPI1_MISO: R103.2 R285.2 ; off-sheet MCU_SPI1_MISO
MCU_SPI1_MOSI: R104.2 ; off-sheet MCU_SPI1_MOSI
MCU_SPI1_SCK: R102.2 ; off-sheet MCU_SPI1_SCK
MCU_STATUS_LED_1: D36.2(A) R94.1 ; off-sheet MCU_STATUS_LED_1
MCU_SWDIO: J3.8 R85.1
MCU_TRACESWO: J3.4 R83.1
MCU_TST: TP1.0 U3.85(TST)
MCU_TSWCLK: J3.5 R88.1
MCU_UART0_RX_SOM_TX: R24.2 ; off-sheet MCU_UART0_RX_SOM_TX
MCU_UART0_TX_SOM_RX: R26.2 ; off-sheet MCU_UART0_TX_SOM_RX
MCU_USART_RXD2: R131.1 ; off-sheet MCU_USART_RXD2
MCU_USART_SCK2: R39.1 ; off-sheet MCU_USART_SCK2
MCU_USART_TXD2: R133.1 ; off-sheet MCU_USART_TXD2
MCU_WD_DONE: R65.1 ; off-sheet MCU_WD_DONE  [project net WD_DONE]
MCU_WD_nRESET: R62.2 ; off-sheet MCU_WD_nRESET  [project net WD_nRESET]
MCU_WD_WAKE: R67.1 ; off-sheet MCU_WD_WAKE  [project net WD_WAKE]
PA00: R11.1 U3.102(PA00)
PA01: R13.1 U3.99(PA01)
PA02: R15.1 U3.93(PA02)
PA03: R17.1 U3.91(PA03)
PA04: R20.1 U3.77(PA04)
PA07_XIN32: C16.1 R280.1 U3.35(PA07) Y5.2(Osc2)
PA08_XOUT32: C17.1 R280.2 U3.36(PA08) Y5.1(Osc1)
PA09: R24.1 U3.75(PA09)
PA10: R26.1 U3.66(PA10)
PA11: R28.1 U3.64(PA11)
PA12: R30.1 U3.68(PA12)
PA13: R32.1 U3.42(PA13)
PA14: R34.1 U3.51(PA14)
PA15: R36.1 U3.49(PA15)
PA16: R37.1 U3.45(PA16)
PA17: R38.1 U3.25(PA17)
PA18: R151.1 U3.24(PA18)
PA19: C213.2 R143.1 U3.23(PA19)
PA20: C215.2 R150.1 U3.22(PA20)
PA22: R44.1 U3.37(PA22)
PA23: R46.1 U3.46(PA23)
PA24: R47.1 U3.56(PA24)
PA25: R48.1 U3.59(PA25)
PA26: R50.1 U3.62(PA26)
PA27: R52.1 U3.70(PA27)
PA28: R54.1 U3.112(PA28)
PA29: R56.1 U3.129(PA29)
PA30: R58.1 U3.116(PA30)
PA31: R59.1 U3.118(PA31)
PB00: C225.2 R73.2 U3.21(PB00)
PB01: C226.2 R75.2 U3.20(PB01)
PB02: C227.2 R77.2 U3.26(PB02)
PB03: C228.2 R79.2 U3.31(PB03)
PB04: R81.2 U3.105(PB04)
PB05: R83.2 R86.2 U3.109(PB05)
PB06: R85.2 U3.79(PB06)
PB07: R88.2 U3.89(PB07)
PB12: R94.2 U3.87(PB12)
PB13: R96.2 U3.144(PB13)
PC00: C217.2 R278.1 U3.11(PC00)
PC01: R64.1 U3.38(PC01)
PC02: R66.1 U3.39(PC02)
PC03: R68.1 U3.40(PC03)
PC04: R69.1 U3.41(PC04)
PC05: R70.1 U3.58(PC05)
PC06: R71.1 U3.54(PC06)
PC07: R72.1 U3.48(PC07)
PC08: R74.1 U3.82(PC08)
PC09: R76.1 U3.86(PC09)
PC10: R78.1 U3.90(PC10)
PC11: R80.1 U3.94(PC11)
PC12: R82.1 U3.17(PC12)
PC13: C218.2 R84.1 U3.19(PC13)
PC14: R87.1 U3.97(PC14)
PC15: C219.2 R89.1 U3.18(PC15)
PC16: R91.1 U3.100(PC16)
PC17: R93.1 U3.103(PC17)
PC18: R95.1 U3.111(PC18)
PC19: R97.1 U3.117(PC19)
PC20: R98.1 U3.120(PC20)
PC21: R99.1 U3.122(PC21)
PC22: R100.1 U3.124(PC22)
PC23: R101.1 U3.127(PC23)
PC24: R102.1 U3.130(PC24)
PC25: R286.1 U3.133(PC25)
PC26: R103.1 U3.13(PC26)
PC27: R104.1 U3.12(PC27)
PC28: R105.1 U3.76(PC28)
PC29: C220.2 R106.1 U3.16(PC29)
PC30: C221.2 R107.1 U3.15(PC30)
PC31: C223.2 R108.1 U3.14(PC31)
PD00: R12.2 U3.1(PD00)
PD01: R14.2 U3.132(PD01)
PD02: R16.2 U3.131(PD02)
PD03: R18.2 U3.128(PD03)
PD04: R19.2 U3.126(PD04)
PD05: R21.2 U3.125(PD05)
PD06: R23.2 U3.121(PD06)
PD07: R22.2 U3.119(PD07)
PD08: R312.2 U3.113(PD08)
PD09: R25.2 U3.110(PD09)
PD10: R27.2 U3.101(PD10)
PD11: R29.2 U3.98(PD11)
PD12: R31.2 U3.92(PD12)
PD13: R33.2 U3.88(PD13)
PD14: R35.2 U3.84(PD14)
PD15: R131.2 U3.106(PD15)
PD16: R133.2 U3.78(PD16)
PD17: R39.2 U3.74(PD17)
PD18: R40.2 U3.69(PD18)
PD19: R41.1 U3.67(PD19)
PD20: R42.2 U3.65(PD20)
PD21: R43.2 U3.63(PD21)
PD22: R45.2 U3.60(PD22)
PD23: R126.2 U3.57(PD23)
PD24: R127.2 U3.55(PD24)
PD25: R49.2 U3.52(PD25)
PD26: R51.2 U3.53(PD26)
PD27: R53.2 U3.47(PD27)
PD28: R55.2 U3.71(PD28)
PD29: R57.1 U3.108(PD29)
PD30: R277.1 U3.34(PD30)
PD31: R60.2 U3.2(PD31)
PE00: R279.2 U3.4(PE00)
PE01: R65.2 U3.6(PE01)
PE02: R67.2 U3.7(PE02)
PE03: R281.2 U3.10(PE03)
PE04: R282.2 U3.27(PE04)
PE05: R283.2 U3.28(PE05)
PHOTO_ADC_CONV: R36.2 ; off-sheet PHOTO_ADC_CONV
PHOTO_ADC_CS: R12.1 ; off-sheet PHOTO_ADC_CS
PHOTO_ADC_EOC: R151.2 ; off-sheet PHOTO_ADC_EOC
PHOTO_SPI0_nCS2: R31.1 ; off-sheet PHOTO_SPI0_nCS2
POW_ONOFF_BUCK_PERI: R282.1 ; off-sheet POW_ONOFF_BUCK_PERI
POW_ONOFF_HD4: R18.1 ; off-sheet POW_ONOFF_HD4
POW_ONOFF_HEATER: R281.1 ; off-sheet POW_ONOFF_HEATER
POW_ONOFF_LP: R23.1 ; off-sheet POW_ONOFF_LP
POW_ONOFF_Solenoid: R16.1 ; off-sheet POW_ONOFF_Solenoid
POW_ONOFF_SOM: R21.1 ; off-sheet POW_ONOFF_SOM
POW_ONOFF_TEC: R19.1 ; off-sheet POW_ONOFF_TEC
SENSOR1_EN: R76.2 ; off-sheet SENSOR1_EN
SENSOR2_EN: R78.2 ; off-sheet SENSOR2_EN
SENSOR3_EN: R54.2 ; off-sheet SENSOR3_EN
SENSOR4_EN: R56.2 ; off-sheet SENSOR4_EN
SENSOR5_EN: R80.2 ; off-sheet SENSOR5_EN
TEC_nCS_1: R95.2 ; off-sheet TEC_nCS_1
TEC_nCS_2: R98.2 ; off-sheet TEC_nCS_2
TEC_nCS_3: R100.2 ; off-sheet TEC_nCS_3
TEC_nCS_4: R29.1 ; off-sheet TEC_nCS_4
TEC_SWEN_1: R58.2 ; off-sheet TEC_SWEN_1
TEC_SWEN_2: R33.1 ; off-sheet TEC_SWEN_2
TEC_SWEN_3: R64.2 ; off-sheet TEC_SWEN_3
TEC_SWEN_4: R66.2 ; off-sheet TEC_SWEN_4
NetC15_2: C15.2 R61.1 R62.1 R63.2
NetC18_2: C18.2 R110.2 U3.140(VBG)
NetD36_1: D36.1(K) R298.1
NetR286_2: R286.2 ; port nSTART

Not connected (* = marked no-connect by the designer): J3 1 7; U3 32(PA21) 73(PA05) 114(PA06) 136(HSDM)* 137(HSDP)*

### Notes on the sheet
- TIOA0
- URXD1
- TWD0
- TWCK0
- TIOB0
- SPI1
- TEC
- FRAM
- UTXD1
- URXD0
- UTXD0
- SPI0
- PHOTO
- QIO1
- QCS
- QSCK
- QIO0
- TIOA1
- SPI0_nCS2
- LASER
- SOM
- QIO2
- AFE0_AD8
- AFE0_AD9
- AFE0_AD7
- TIOB1
- PWMEXTRG1
- SPI0_MISO
- PSRAM (SOM)
- SPI0_MOSI
- SPI0_SPCK
- URXD2
- I2C2
- IO EXPANDED
- TIOA2
- TIOB2
- TWD2
- TWCK2
- UTXD2
- HD4
- SPI0_nCS1
- AFE1_AD9
- QIO3
- TIOA9
- I2C1
- RTC
- SW TEC
- TIOA6
- TIOB6
- AFE1_AD10
- AFE0_AD4
- 390
- (near C16) 32.768KHz clock
- CANRX1
- TIOA7
- AFE0_AD2
- AFE0_AD5
- AFE1_AD0
- TWD1
- I2C0
- cảm biến gia tốc
- 4 Flow sensor
- AFE1_AD2
- AFE1_AD1
- CANTX1
- TWCK1
- External sensor
- SPI1_MISO
- SPI1_MOSI
- SPI1_SPCK
- TIOA3
- SPI1_nCS1
- AFE1_AD4
- AFE1_AD5
- AFE1_AD6
- Labels drawn without touching a wire or pin: PA05, PA06
- Project:
- BEE-1012
- Sub-system:
- SATELLITE_EXP_CONTROLLER
- Design by:
- SANG HUYNH
- BAO BUI
- Sheet title:
- Sheet
- A3
- of
- Checked by:
- Approved by:
- VU PHAM
- Revision:
- Document No:
- Size:
- Date:

### Library data of the parts
C15-C20 C23-C39 C213 C215 C217-C221 C223 C225-C228 = _CAP_C_2: CAP
C21 C22 = _CAP_C_High_2: CAP High Value
R11-R89 R91 R93-R110 R126 R127 R131 R133 R141 R143 R150 R151 R277-R283 R285 R286 R298 R312 = _RES_B_2: RES
TP1 TP2 = Test Point: Solder: NF
U3 = A06-1541: SAM 32-bit ARM Cortex-M* RISC MCU, SAMV71B Series, QFP144; PartGroup: Integrated Circuits,MCU, MPU, DSP,ARM MCU; Manufacturer: MICROCHIP; MPN: ATSAMV71Q21B-AAB; TemperatureRange: -40Â°C to +105Â°C; AN: A06-1541; Value: SAMV71Q21B; Height: 1,60000002384186
XC2 = A07-0042: Fox FQ5032B 12.0MHz SMD crystal 738B-12; PartGroup: Frequency devices,Crystals,SMD; Manufacturer: Fox  Electronics; MPN: FQ5032B-12.000; Tolerance: Â±30ppm; TemperatureRange: 0Â°C ~ 70Â°C; AN: A07-0042; Height: 1,20000004768372
Y5 = OSC_32.768kHz: Crystal; Manufacturer 1: NDK; MCHP-ID: OSC1092; Description_: CRYSTAL 32.768kHz 12.5pF SMD NX2012SA; Dev Tools Status: Production; Owner: Jamus Griego; Tolerance: ±20ppm; Load Capacitance: 12.5pF; Populated: YES; Revision: 1; Symbol: Crystal 2 Pins; Status: MCL Design; ComponentLink1URL: https://chn-vm-apps.microchip.com/mchprepo/parts/Datasheets/c_NX2012SA-STD-MUB-1_e.pdf; ComponentLink1Description: SVN Datasheet; ComponentLink2URL: C:\ALTIUM_WORK\00001_MCHP-CDB\Datasheets\c_NX2012SA-STD-MUB-1_e.pdf; ComponentLink2Description: Local Datasheet; ComponentLink3URL: C:\ALTIUM_WORK\00001_MCHP-CDB\Library\LibraryRefs\Crystal 2 Pins.SchLib; ComponentLink3Description: Open Symbol; ComponentLink4URL: C:\ALTIUM_WORK\00001_MCHP-CDB\Library\Footprints\CRYSTAL_NX2012SA.PcbLib; ComponentLink4Description: Open Footprint; ComponentLink5Description: Open Footprint 2; ComponentLink6Description: Open Footprint 3; ComponentLink7Description: Open Footprint 4; Type: Crystal; Category: Crystal/Oscillator; Supplier 1: Digi-Key; Supplier Part Number 1: 644-1219-1-ND; Quantity Override: 1

## Sheet 12_CONSOLE.SchDoc
size 420 x 297 mm; SheetNumber: 21; SheetTotal: 33
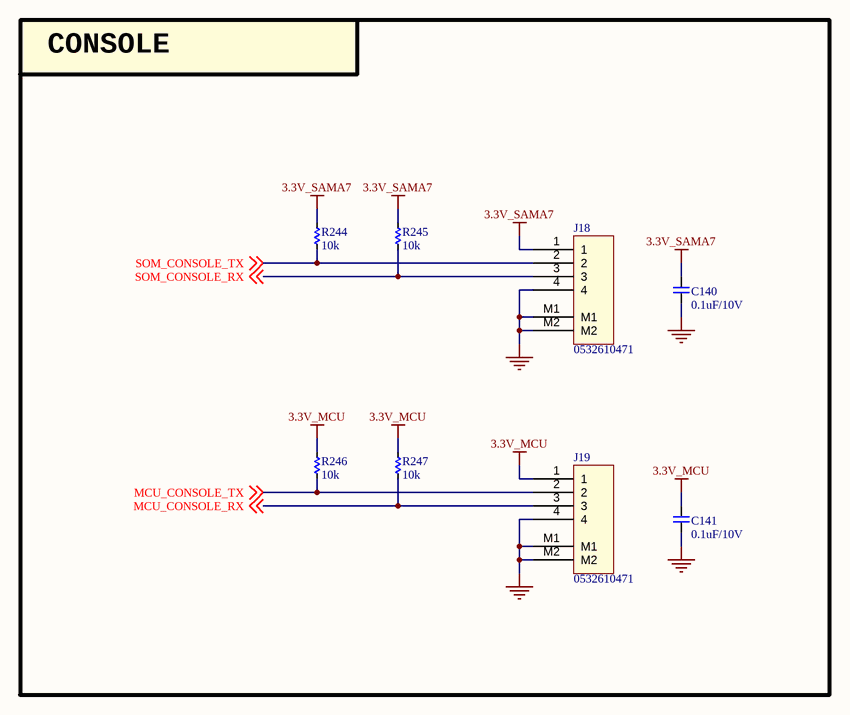
[diagram p25: 12_CONSOLE.SchDoc]

### Parts
(Parts that share a designator on the sheet are numbered #1, #2 ... from top to bottom, then left to right.)
C140#2  0.1uF/10V  [CAP_C_1005X50_L]
C141#2  0.1uF/10V  [CAP_C_1005X50_L]
J18  0532610471  [MOLEX_0532610471]
J19  0532610471  [MOLEX_0532610471]
R244  10k  [RES_C_1005x30_L]
R245  10k  [RES_C_1005x30_L]
R246  10k  [RES_C_1005x30_L]
R247  10k  [RES_C_1005x30_L]

### Blocks framed on the sheet
CONSOLE: C140#2 C141#2 J18 J19 R244-R247

### Nets
3.3V_MCU: C141#2.2 J19.1 R246.2 R247.2
3.3V_SAMA7: C140#2.2 J18.1 R244.2 R245.2
GND: C140#2.1 C141#2.1 J18.4 J18.M1 J18.M2 J19.4 J19.M1 J19.M2
MCU_CONSOLE_RX: J19.3 R247.1 ; off-sheet MCU_CONSOLE_RX
MCU_CONSOLE_TX: J19.2 R246.1 ; off-sheet MCU_CONSOLE_TX
SOM_CONSOLE_RX: J18.3 R245.1 ; off-sheet SOM_CONSOLE_RX
SOM_CONSOLE_TX: J18.2 R244.1 ; off-sheet SOM_CONSOLE_TX

### Notes on the sheet
- Project:
- BEE-1012
- Sub-system:
- SATELLITE_EXP_CONTROLLER
- Design by:
- SANG HUYNH
- BAO BUI
- Sheet title:
- Sheet
- A3
- of
- Checked by:
- Approved by:
- VU PHAM
- Revision:
- Document No:
- Size:
- Date:

### Library data of the parts
C140#2 C141#2 = _CAP_C_2: CAP
J18 J19 = Header 4x1_2M
R244-R247 = _RES_B_2: RES

## Sheet 13_MRAM_RTC_WDT.SchDoc
size 420 x 297 mm; SheetNumber: 22; SheetTotal: 33
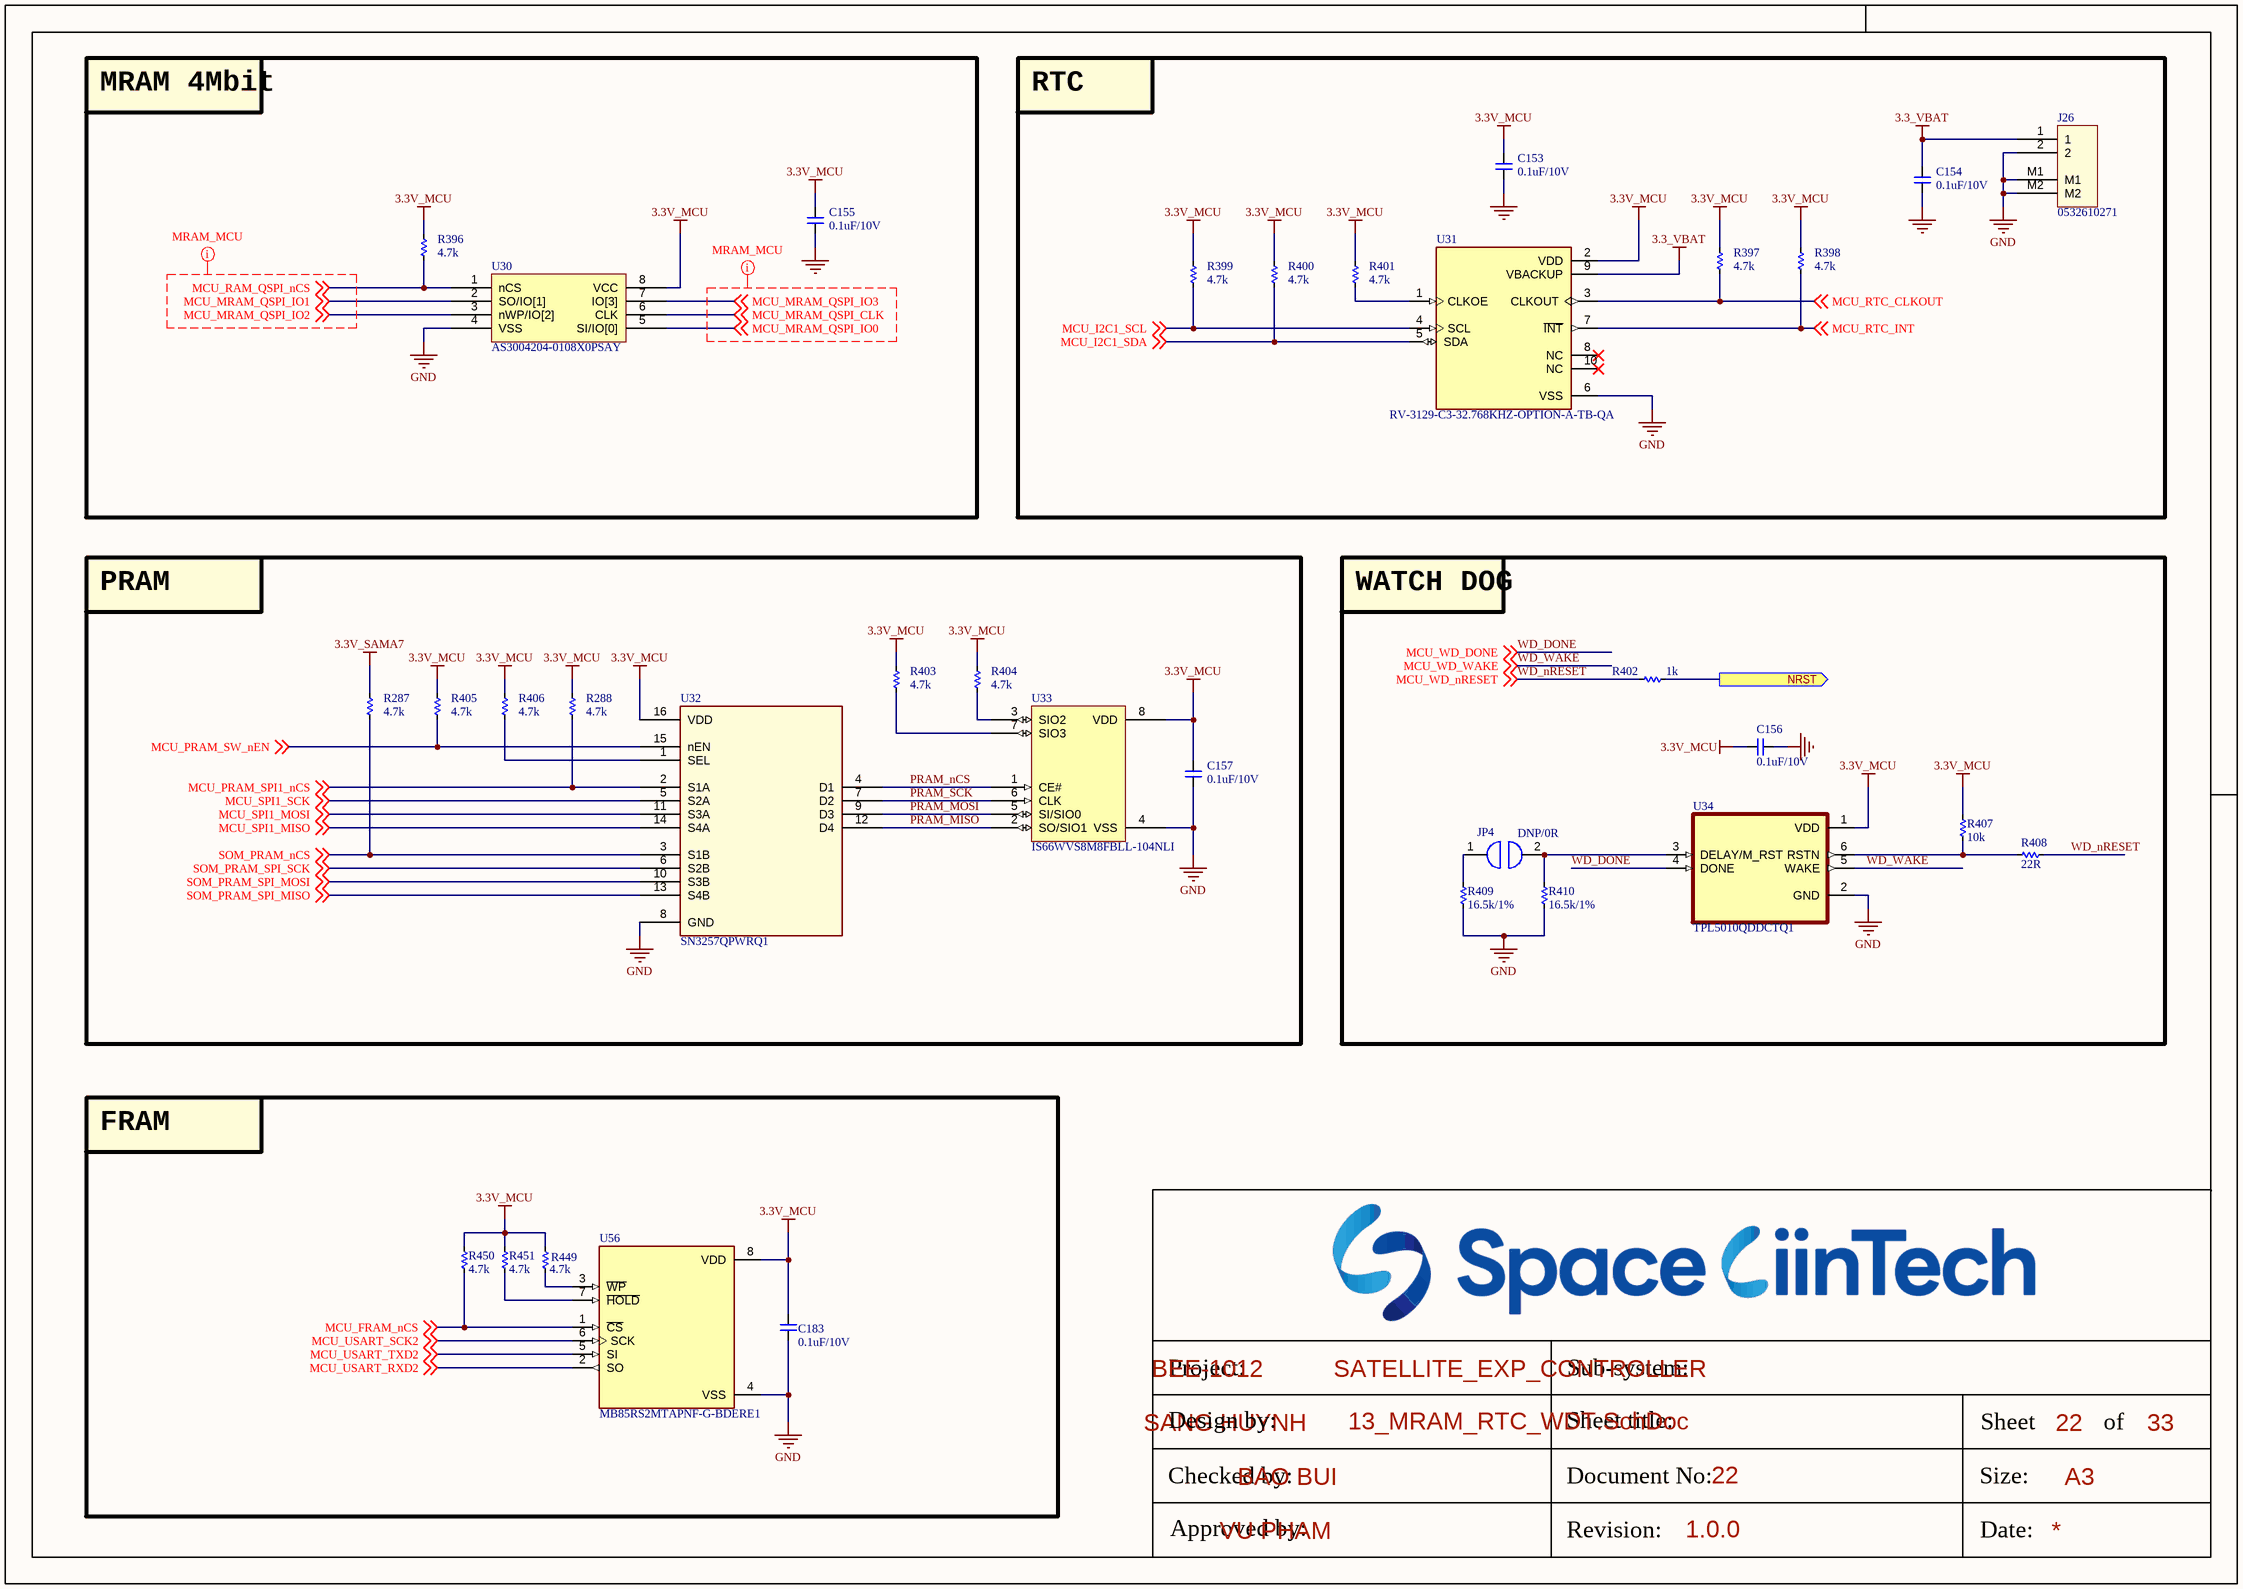
[diagram p26: 13_MRAM_RTC_WDT.SchDoc]

### Parts
(Parts that share a designator on the sheet are numbered #1, #2 ... from top to bottom, then left to right.)
C153#2  0.1uF/10V  [CAP_C_1005X50_L]
C154#2  0.1uF/10V  [CAP_C_1005X50_L]
C155#2  0.1uF/10V  [CAP_C_1005X50_L]
C156#2  0.1uF/10V  [CAP_C_1005X50_L]
C157#2  0.1uF/10V  [CAP_C_1005X50_L]
C183  0.1uF/10V  [CAP_C_1005X50_L]
J26  0532610271  [molex_0532610271]
JP4#2  DNP/0R  [JUMPER_1608]
R287  4.7k  [RES_C_1005x30_L]
R288  4.7k  [RES_C_1005x30_L]
R396  4.7k  [RES_C_1005x30_L]
R397  4.7k  [RES_C_1005x30_L]
R398  4.7k  [RES_C_1005x30_L]
R399  4.7k  [RES_C_1005x30_L]
R400  4.7k  [RES_C_1005x30_L]
R401  4.7k  [RES_C_1005x30_L]
R402  1k  [RES_C_1005x30_L]
R403  4.7k  [RES_C_1005x30_L]
R404  4.7k  [RES_C_1005x30_L]
R405  4.7k  [RES_C_1005x30_L]
R406  4.7k  [RES_C_1005x30_L]
R407  10k  [RES_C_1005x30_L]
R408  22R  [RES_C_1005x30_L]
R409  16.5k/1%  [RES_C_1005x30_L]
R410  16.5k/1%  [RES_C_1005x30_L]
R449  4.7k  [RES_C_1005x30_L]
R450  4.7k  [RES_C_1005x30_L]
R451  4.7k  [RES_C_1005x30_L]
U30  AS3004204-0108X0PSAY  [SOIC127P790X216-8]
U31  RV-3129-C3-32.768KHZ-OPTION-A-TB-QA  [IC_RV-3129-C3_32.768KHZ_OPTION_A_TB_QA]
U32  SN3257QPWRQ1  [SOIC_PRQ1_TEX]
U33  IS66WVS8M8FBLL-104NLI  [SOIC8_150MIL_N_ISI]
U34  TPL5010QDDCTQ1  [SOT95P280X145-6N]
U56  MB85RS2MTAPNF-G-BDERE1  [SOIC127P602X173-8N]

### Blocks framed on the sheet
MRAM 4Mbit: C155#2 R396 U30
RTC: C153#2 C154#2 J26 R397-R401 U31
PRAM: C157#2 R287 R288 R403-R406 U32 U33
WATCH DOG: C156#2 JP4#2 R402 R407-R410 U34
FRAM: C183 R449-R451 U56

### Ports
NRST (out)

### Nets
3.3_VBAT: C154#2.2 J26.1 U31.9(VBACKUP)
3.3V_MCU: C153#2.2 C155#2.2 C156#2.2 C157#2.1 C183.2 R288.2 R396.2 R397.2 R398.2 R399.2 R400.2 R401.1 R403.2 R404.2 R405.2 R406.2 R407.2 R449.2 R450.2 R451.2 U30.8(VCC) U31.2(VDD) U32.16(VDD) U33.8(VDD) U34.1(VDD) U56.8(VDD)
3.3V_SAMA7: R287.2
GND: C153#2.1 C154#2.1 C155#2.1 C156#2.1 C157#2.2 C183.1 J26.2 J26.M1 J26.M2 R409.1 R410.1 U30.4(VSS) U31.6(VSS) U32.8(GND) U33.4(VSS) U34.2(GND) U56.4(VSS)
MCU_FRAM_nCS: R450.1 U56.1(~{CS}) ; off-sheet MCU_FRAM_nCS
MCU_I2C1_SCL: R399.1 U31.4(SCL) ; off-sheet MCU_I2C1_SCL
MCU_I2C1_SDA: R400.1 U31.5(SDA) ; off-sheet MCU_I2C1_SDA
MCU_MRAM_QSPI_CLK: U30.6(CLK) ; off-sheet MCU_MRAM_QSPI_CLK
MCU_MRAM_QSPI_IO0: U30.5(SI/IO[0]) ; off-sheet MCU_MRAM_QSPI_IO0
MCU_MRAM_QSPI_IO1: U30.2(SO/IO[1]) ; off-sheet MCU_MRAM_QSPI_IO1
MCU_MRAM_QSPI_IO2: U30.3(nWP/IO[2]) ; off-sheet MCU_MRAM_QSPI_IO2
MCU_MRAM_QSPI_IO3: U30.7(IO[3]) ; off-sheet MCU_MRAM_QSPI_IO3
MCU_PRAM_SPI1_nCS: R288.1 U32.2(S1A) ; off-sheet MCU_PRAM_SPI1_nCS
MCU_PRAM_SW_nEN: R405.1 U32.15(nEN) ; off-sheet MCU_PRAM_SW_nEN
MCU_RAM_QSPI_nCS: R396.1 U30.1(nCS) ; off-sheet MCU_RAM_QSPI_nCS
MCU_RTC_CLKOUT: R397.1 U31.3(CLKOUT) ; off-sheet MCU_RTC_CLKOUT
MCU_RTC_INT: R398.1 U31.7(~{INT}) ; off-sheet MCU_RTC_INT
MCU_SPI1_MISO: U32.14(S4A) ; off-sheet MCU_SPI1_MISO
MCU_SPI1_MOSI: U32.11(S3A) ; off-sheet MCU_SPI1_MOSI
MCU_SPI1_SCK: U32.5(S2A) ; off-sheet MCU_SPI1_SCK
MCU_USART_RXD2: U56.2(SO) ; off-sheet MCU_USART_RXD2
MCU_USART_SCK2: U56.6(SCK) ; off-sheet MCU_USART_SCK2
MCU_USART_TXD2: U56.5(SI) ; off-sheet MCU_USART_TXD2
PRAM_MISO: U32.12(D4) U33.2(SO/SIO1)
PRAM_MOSI: U32.9(D3) U33.5(SI/SIO0)
PRAM_nCS: U32.4(D1) U33.1(CE#)
PRAM_SCK: U32.7(D2) U33.6(CLK)
SOM_PRAM_nCS: R287.1 U32.3(S1B) ; off-sheet SOM_PRAM_nCS
SOM_PRAM_SPI_MISO: U32.13(S4B) ; off-sheet SOM_PRAM_SPI_MISO
SOM_PRAM_SPI_MOSI: U32.10(S3B) ; off-sheet SOM_PRAM_SPI_MOSI
SOM_PRAM_SPI_SCK: U32.6(S2B) ; off-sheet SOM_PRAM_SPI_SCK
WD_DONE: U34.4(DONE) ; off-sheet MCU_WD_DONE  [also labelled MCU_WD_DONE]
WD_nRESET: R402.2 R408.1 ; off-sheet MCU_WD_nRESET  [also labelled MCU_WD_nRESET]
WD_WAKE: U34.5(WAKE) ; off-sheet MCU_WD_WAKE  [also labelled MCU_WD_WAKE]
NetC300_2: R402.1 ; port NRST
NetJP4#2_1: JP4#2.1 R409.2
NetJP4#2_2: JP4#2.2 R410.2 U34.3(DELAY/M_RST)
NetR401_2: R401.2 U31.1(CLKOE)
NetR403_1: R403.1 U33.7(SIO3)
NetR404_1: R404.1 U33.3(SIO2)
NetR406_1: R406.1 U32.1(SEL)
NetR407_1: R407.1 R408.2 U34.6(RSTN)
NetR449_1: R449.1 U56.3(~{WP})
NetR451_1: R451.1 U56.7(~{HOLD})

Not connected (* = marked no-connect by the designer): U31 8(NC)* 10(NC)*

### Layout directives
net class MRAM_MCU: MCU_MRAM_QSPI_CLK, MCU_MRAM_QSPI_IO0, MCU_MRAM_QSPI_IO1, MCU_MRAM_QSPI_IO2, MCU_MRAM_QSPI_IO3, MCU_RAM_QSPI_nCS

### Notes on the sheet
- Project:
- BEE-1012
- Sub-system:
- SATELLITE_EXP_CONTROLLER
- Design by:
- SANG HUYNH
- BAO BUI
- Sheet title:
- Sheet
- A3
- of
- Checked by:
- Approved by:
- VU PHAM
- Revision:
- Document No:
- Size:
- Date:

### Library data of the parts
C153#2 C154#2 C155#2 C156#2 C157#2 = _CAP_C_2: CAP
C183 = _CAP_C_2: CAP CHIP
J26 = Header 2x1_2M
JP4#2 = JUMPER
R287 R288 R396-R410 R449-R451 = _RES_B_2: RES
U30 = IC_RAM_AS3004204-0108X0PSAY
U31 = RV-3129-C3_32.768KHZ_OPTION_A_TB_QA: Real-Time Clock Module, Temperature compensated, in 2.5 x 3.7 mm package; MF: Micro Crystal; MP: RV-3129-C3 32.768KHZ OPTION A TB QA; SnapEDA_Link: https://www.snapeda.com/parts/RV-3129-C3%2032.768KHZ%20OPTION%20A%20TB%20QA/Micro+Crystal/view-part/?ref=snap; Package: QFN-10 Micro Crystal; Value: *; Check_prices: https://www.snapeda.com/parts/RV-3129-C3%2032.768KHZ%20OPTION%20A%20TB%20QA/Micro+Crystal/view-part/?ref=eda
U32 = IC_SW_SPI_SN3257QPWRQ1: Automotive 5-V, 2:1 (SPDT), 4-channel switch with 1.8-V logic and powered-off protection 16-TSSOP -40 to 125; Manufacturer_Name: Texas Instruments; Copyright: Copyright (C) 2025 Ultra Librarian. All rights reserved.; Manufacturer_Part_Number: SN3257QPWRQ1; Datasheet: https://www.ti.com/lit/gpn/sn3257-q1; RefDes: RefDes; Type: Type
U33 = IS66WVS4M8BLL-104NLI: No Description Available; Manufacturer_Name: ISSI; Type: Memory; Copyright: Copyright (C) 2025 Ultra Librarian. All rights reserved.; Manufacturer_Part_Number: IS66WVS4M8BLL-104NLI; RefDes: RefDes
U56 = MB85RS2MTAPNF-G-BDERE1: FRAM _Ferroelectric RAM_ Memory IC 2Mb _256K x 8_ SPI 40MHz 8-SOP; MF: Fujitsu Electronics; Package: SO-8 Fujitsu; Value: *; Digi-Key_Purchase_URL: https://www.digikey.com/product-detail/en/fujitsu-electronics-america-inc/MB85RS2MTAPNF-G-BDERE1/865-1286-1-ND/7916252?utm_source=snapeda&utm_medium=aggregator&utm_campaign=symbol; Digi-Key_Part_Number: 865-1286-1-ND; SnapEDA_Link: https://www.snapeda.com/parts/MB85RS2MTAPNF-G-BDERE1/Fujitsu%20Electronics%20America%2C%20Inc./view-part/2344795/?ref=snap; MP: MB85RS2MTAPNF-G-BDERE1
U34 = TPL5010QDDCTQ1: Package: None; Price: None; Value: *; MP: TPL5010QDDCTQ1; Availability: Unavailable

## Sheet 14_NTC_TEMPSENSOR.SchDoc
size 420 x 297 mm; SheetNumber: 23; SheetTotal: 33
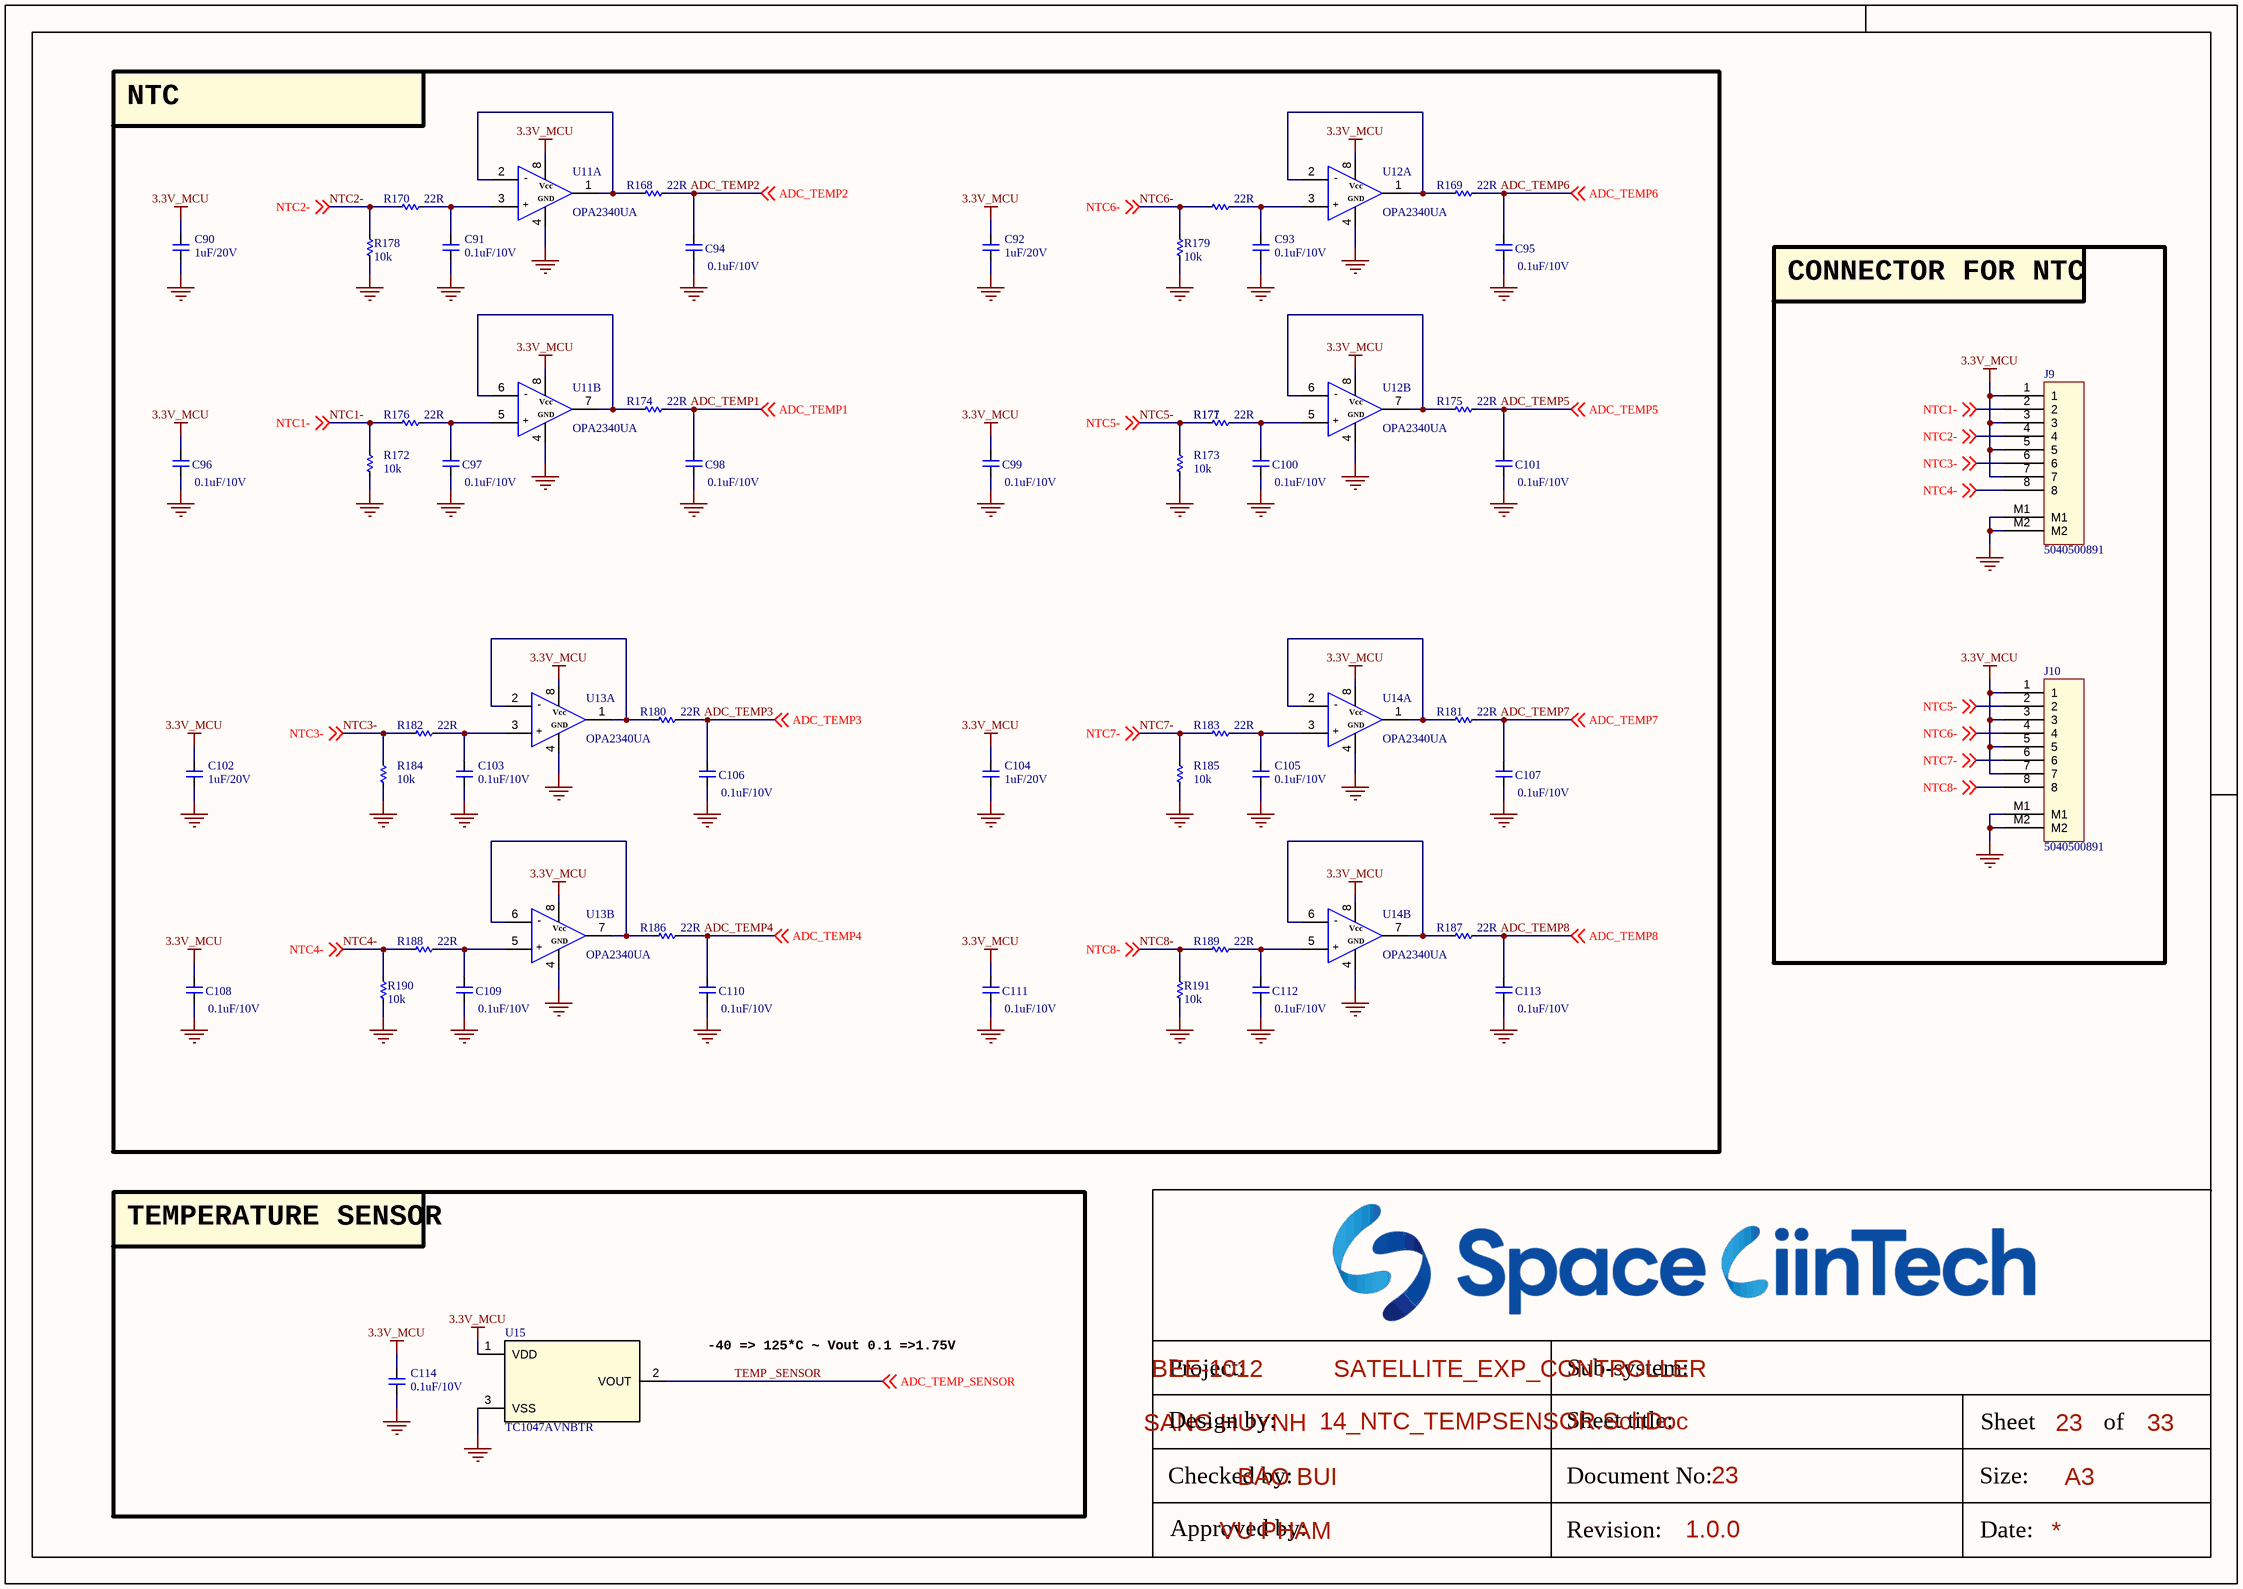
[diagram p27: 14_NTC_TEMPSENSOR.SchDoc]

### Parts
(Parts that share a designator on the sheet are numbered #1, #2 ... from top to bottom, then left to right.)
C90  1uF/20V  [CAP_C_1005X50_L]
C91  0.1uF/10V  [CAP_C_1005X50_L]
C92  1uF/20V  [CAP_C_1005X50_L]
C93  0.1uF/10V  [CAP_C_1005X50_L]
C94  0.1uF/10V  [CAP_C_1005X50_L]
C95  0.1uF/10V  [CAP_C_1005X50_L]
C96  0.1uF/10V  [CAP_C_1005X50_L]
C97  0.1uF/10V  [CAP_C_1005X50_L]
C98  0.1uF/10V  [CAP_C_1005X50_L]
C99  0.1uF/10V  [CAP_C_1005X50_L]
C100  0.1uF/10V  [CAP_C_1005X50_L]
C101  0.1uF/10V  [CAP_C_1005X50_L]
C102  1uF/20V  [CAP_C_1005X50_L]
C103  0.1uF/10V  [CAP_C_1005X50_L]
C104  1uF/20V  [CAP_C_1005X50_L]
C105  0.1uF/10V  [CAP_C_1005X50_L]
C106  0.1uF/10V  [CAP_C_1005X50_L]
C107  0.1uF/10V  [CAP_C_1005X50_L]
C108  0.1uF/10V  [CAP_C_1005X50_L]
C109  0.1uF/10V  [CAP_C_1005X50_L]
C110  0.1uF/10V  [CAP_C_1005X50_L]
C111  0.1uF/10V  [CAP_C_1005X50_L]
C112  0.1uF/10V  [CAP_C_1005X50_L]
C113  0.1uF/10V  [CAP_C_1005X50_L]
C114  0.1uF/10V  [CAP_C_1005X50_L]
J9  5040500891  [MOLEX_5040500891]
J10  5040500891  [MOLEX_5040500891]
R168#2  22R  [RES_C_1005x30_L]
R169#2  22R  [RES_C_1005x30_L]
R170#2  22R  [RES_C_1005x30_L]
R171#2  22R  [RES_C_1005x30_L]
R172#2  10k  [RES_C_1005x30_L]
R173#2  10k  [RES_C_1005x30_L]
R174#2  22R  [RES_C_1005x30_L]
R175#2  22R  [RES_C_1005x30_L]
R176#2  22R  [RES_C_1005x30_L]
R177#2  22R  [RES_C_1005x30_L]
R178#2  10k  [RES_C_1005x30_L]
R179#2  10k  [RES_C_1005x30_L]
R180#2  22R  [RES_C_1005x30_L]
R181#2  22R  [RES_C_1005x30_L]
R182#2  22R  [RES_C_1005x30_L]
R183#2  22R  [RES_C_1005x30_L]
R184#2  10k  [RES_C_1005x30_L]
R185#2  10k  [RES_C_1005x30_L]
R186#2  22R  [RES_C_1005x30_L]
R187#2  22R  [RES_C_1005x30_L]
R188#2  22R  [RES_C_1005x30_L]
R189#2  22R  [RES_C_1005x30_L]
R190#2  10k  [RES_C_1005x30_L]
R191#2  10k  [RES_C_1005x30_L]
U11  OPA2340UA  [SOIC127P602X173-8N]  (parts A,B of 2)
U12  OPA2340UA  [SOIC127P602X173-8N]  (parts A,B of 2)
U13  OPA2340UA  [SOIC127P602X173-8N]  (parts A,B of 2)
U14  OPA2340UA  [SOIC127P602X173-8N]  (parts A,B of 2)
U15  TC1047AVNBTR  [SOT95P240X120-3N]

### Blocks framed on the sheet
NTC: C90-C113 R168#2 R169#2 R170#2 R171#2 R172#2 R173#2 R174#2 R175#2 R176#2 R177#2 R178#2 R179#2 R180#2 R181#2 R182#2 R183#2 R184#2 R185#2 R186#2 R187#2 R188#2 R189#2 R190#2 R191#2 U11-U14
CONNECTOR FOR NTC: J9 J10
TEMPERATURE SENSOR: C114 U15

### Nets
3.3V_MCU: C90.2 C92.2 C96.2 C99.2 C102.2 C104.2 C108.2 C111.2 C114.2 J9.1 J9.3 J9.5 J9.7 J10.1 J10.3 J10.5 J10.7 U11.8 U12.8 U13.8 U14.8 U15.1(VDD)
GND: C90.1 C91.1 C92.1 C93.1 C94.1 C95.1 C96.1 C97.1 C98.1 C99.1 C100.1 C101.1 C102.1 C103.1 C104.1 C105.1 C106.1 C107.1 C108.1 C109.1 C110.1 C111.1 C112.1 C113.1 C114.1 J9.M1 J9.M2 J10.M1 J10.M2 R172#2.1 R173#2.1 R178#2.1 R179#2.1 R184#2.1 R185#2.1 R190#2.1 R191#2.1 U11.4 U12.4 U13.4 U14.4 U15.3(VSS)
ADC_TEMP1: C98.2 R174#2.2 ; off-sheet ADC_TEMP1
ADC_TEMP2: C94.2 R168#2.2 ; off-sheet ADC_TEMP2
ADC_TEMP3: C106.2 R180#2.2 ; off-sheet ADC_TEMP3
ADC_TEMP4: C110.2 R186#2.2 ; off-sheet ADC_TEMP4
ADC_TEMP5: C101.2 R175#2.2 ; off-sheet ADC_TEMP5
ADC_TEMP6: C95.2 R169#2.2 ; off-sheet ADC_TEMP6
ADC_TEMP7: C107.2 R181#2.2 ; off-sheet ADC_TEMP7
ADC_TEMP8: C113.2 R187#2.2 ; off-sheet ADC_TEMP8
NTC1-: J9.2 R172#2.2 R176#2.1 ; off-sheet NTC1-
NTC2-: J9.4 R170#2.1 R178#2.2 ; off-sheet NTC2-
NTC3-: J9.6 R182#2.1 R184#2.2 ; off-sheet NTC3-
NTC4-: J9.8 R188#2.1 R190#2.2 ; off-sheet NTC4-
NTC5-: J10.2 R173#2.2 R177#2.1 ; off-sheet NTC5-
NTC6-: J10.4 R171#2.1 R179#2.2 ; off-sheet NTC6-
NTC7-: J10.6 R183#2.1 R185#2.2 ; off-sheet NTC7-
NTC8-: J10.8 R189#2.1 R191#2.2 ; off-sheet NTC8-
TEMP _SENSOR: U15.2(VOUT) ; off-sheet ADC_TEMP_SENSOR  [also labelled ADC_TEMP_SENSOR]
NetC91_2: C91.2 R170#2.2 U11.3
NetC93_2: C93.2 R171#2.2 U12.3
NetC97_2: C97.2 R176#2.2 U11.5
NetC100_2: C100.2 R177#2.2 U12.5
NetC103_2: C103.2 R182#2.2 U13.3
NetC105_2: C105.2 R183#2.2 U14.3
NetC109_2: C109.2 R188#2.2 U13.5
NetC112_2: C112.2 R189#2.2 U14.5
NetR168#2_1: R168#2.1 U11.1 U11.2
NetR169#2_1: R169#2.1 U12.1 U12.2
NetR174#2_1: R174#2.1 U11.6 U11.7
NetR175#2_1: R175#2.1 U12.6 U12.7
NetR180#2_1: R180#2.1 U13.1 U13.2
NetR181#2_1: R181#2.1 U14.1 U14.2
NetR186#2_1: R186#2.1 U13.6 U13.7
NetR187#2_1: R187#2.1 U14.6 U14.7

### Notes on the sheet
- -40 => 125*C ~ Vout 0.1 =>1.75V
- Project:
- BEE-1012
- Sub-system:
- SATELLITE_EXP_CONTROLLER
- Design by:
- SANG HUYNH
- BAO BUI
- Sheet title:
- Sheet
- A3
- of
- Checked by:
- Approved by:
- VU PHAM
- Revision:
- Document No:
- Size:
- Date:
- (in symbol OPA2340UA, part A) -; Vcc; GND; +
- (in symbol OPA2340UA, part B) -; Vcc; GND; +

### Library data of the parts
C90-C114 = _CAP_C_2: CAP
J9 J10 = Header 8x1_2M
R168#2 R169#2 R170#2 R171#2 R172#2 R173#2 R174#2 R175#2 R176#2 R177#2 R178#2 R179#2 R180#2 R181#2 R182#2 R183#2 R184#2 R185#2 R186#2 R187#2 R188#2 R189#2 R190#2 R191#2 = _RES_B_2: RES
U15 = IC_SENSOR_TC1047AVNBTR: Temperature Sensor Analog, Local -40°C ~ 125°C 10mV/°C SOT-23-3

## Sheet 15_HEATER.SchDoc
size 420 x 297 mm; SheetNumber: 24; SheetTotal: 33
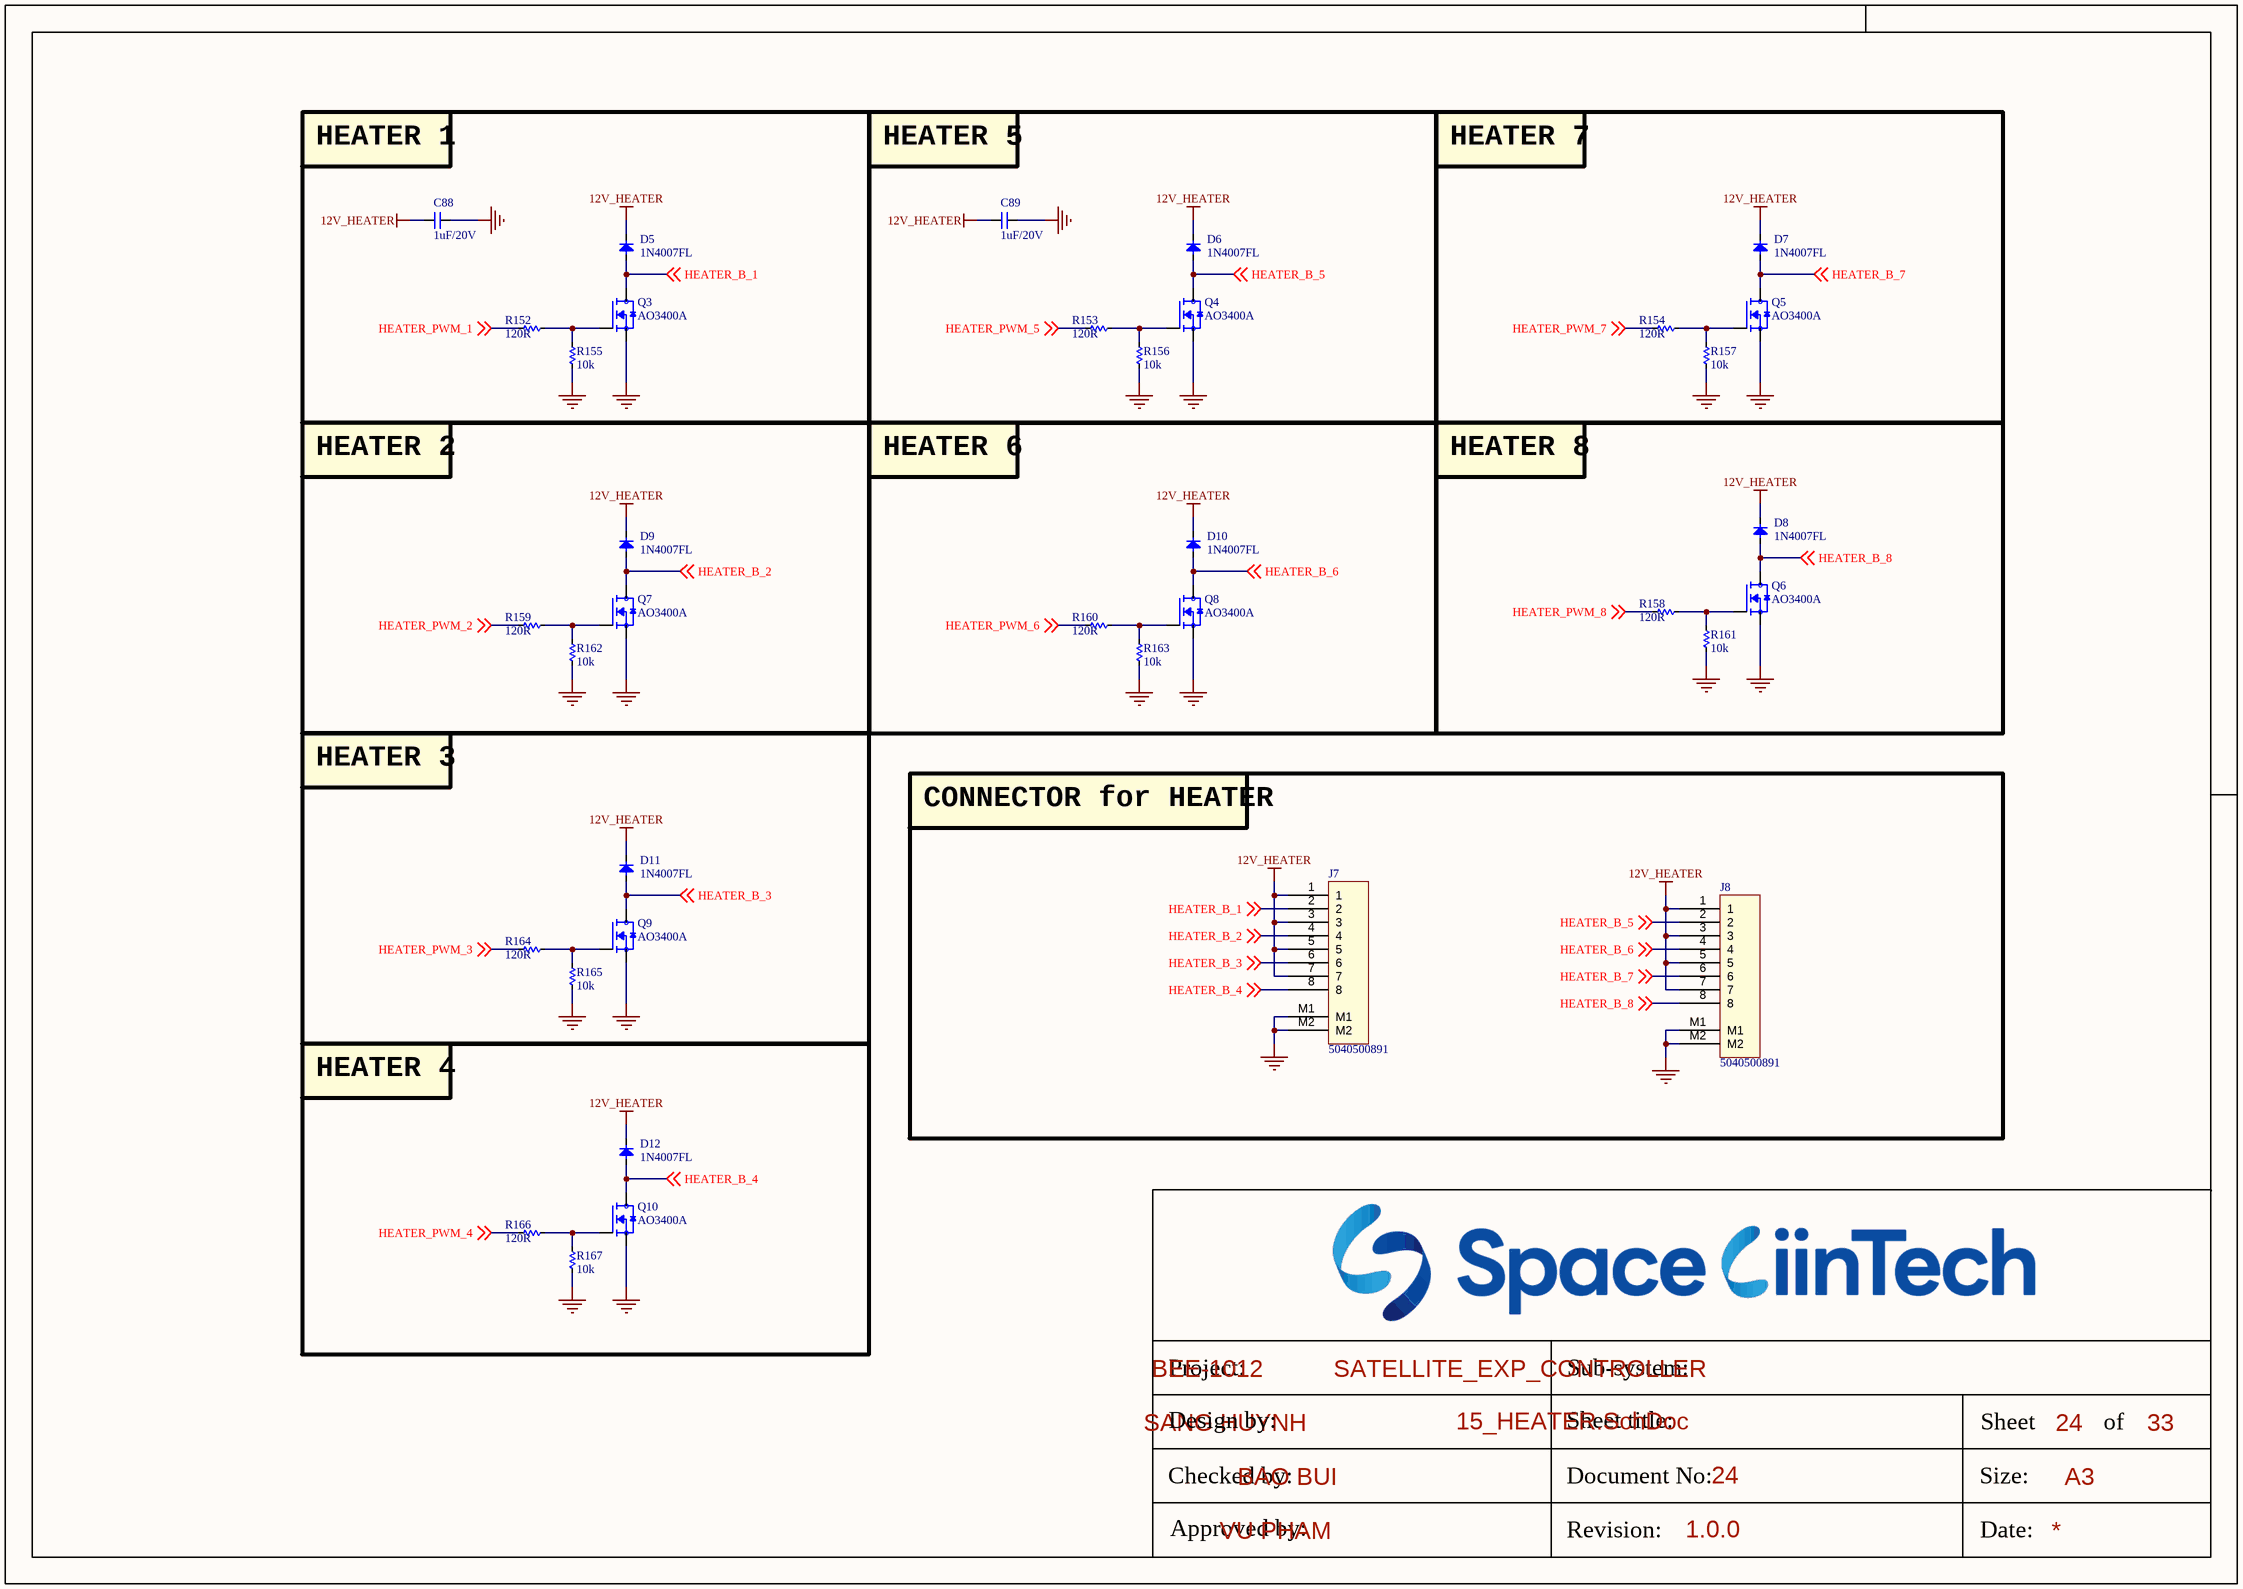
[diagram p28: 15_HEATER.SchDoc]

### Parts
(Parts that share a designator on the sheet are numbered #1, #2 ... from top to bottom, then left to right.)
C88  1uF/20V  [CAP_C_1005X50_L]
C89  1uF/20V  [CAP_C_1005X50_L]
D5  1N4007FL  [SOD3717X145N]
D6  1N4007FL  [SOD3717X145N]
D7  1N4007FL  [SOD3717X145N]
D8  1N4007FL  [SOD3717X145N]
D9  1N4007FL  [SOD3717X145N]
D10  1N4007FL  [SOD3717X145N]
D11  1N4007FL  [SOD3717X145N]
D12#2  1N4007FL  [SOD3717X145N]
J7  5040500891  [MOLEX_5040500891]
J8  5040500891  [MOLEX_5040500891]
Q3  AO3400A  [SOT95P240X120-3N]
Q4  AO3400A  [SOT95P240X120-3N]
Q5  AO3400A  [SOT95P240X120-3N]
Q6  AO3400A  [SOT95P240X120-3N]
Q7  AO3400A  [SOT95P240X120-3N]
Q8  AO3400A  [SOT95P240X120-3N]
Q9  AO3400A  [SOT95P240X120-3N]
Q10  AO3400A  [SOT95P240X120-3N]
R152#2  120R  [RES_C_1005x30_L]
R153#2  120R  [RES_C_1005x30_L]
R154#2  120R  [RES_C_1005x30_L]
R155#2  10k  [RES_C_1005x30_L]
R156#2  10k  [RES_C_1005x30_L]
R157#2  10k  [RES_C_1005x30_L]
R158#2  120R  [RES_C_1005x30_L]
R159#2  120R  [RES_C_1005x30_L]
R160#2  120R  [RES_C_1005x30_L]
R161#2  10k  [RES_C_1005x30_L]
R162#2  10k  [RES_C_1005x30_L]
R163#2  10k  [RES_C_1005x30_L]
R164#2  120R  [RES_C_1005x30_L]
R165#2  10k  [RES_C_1005x30_L]
R166#2  120R  [RES_C_1005x30_L]
R167#2  10k  [RES_C_1005x30_L]

### Blocks framed on the sheet
HEATER 1: C88 D5 Q3 R152#2 R155#2
HEATER 5: C89 D6 Q4 R153#2 R156#2
HEATER 7: D7 Q5 R154#2 R157#2
HEATER 2: D9 Q7 R159#2 R162#2
HEATER 6: D10 Q8 R160#2 R163#2
HEATER 8: D8 Q6 R158#2 R161#2
HEATER 3: D11 Q9 R164#2 R165#2
CONNECTOR for HEATER: J7 J8
HEATER 4: D12#2 Q10 R166#2 R167#2

### Nets
12V_HEATER: C88.2 C89.2 D5.1(K) D6.1(K) D7.1(K) D8.1(K) D9.1(K) D10.1(K) D11.1(K) D12#2.1(K) J7.1 J7.3 J7.5 J7.7 J8.1 J8.3 J8.5 J8.7
GND: C88.1 C89.1 J7.M1 J7.M2 J8.M1 J8.M2 Q3.2(S) Q4.2(S) Q5.2(S) Q6.2(S) Q7.2(S) Q8.2(S) Q9.2(S) Q10.2(S) R155#2.1 R156#2.1 R157#2.1 R161#2.1 R162#2.1 R163#2.1 R165#2.1 R167#2.1
HEATER_B_1: D5.2(A) J7.2 Q3.3(D) ; off-sheet HEATER_B_1
HEATER_B_2: D9.2(A) J7.4 Q7.3(D) ; off-sheet HEATER_B_2
HEATER_B_3: D11.2(A) J7.6 Q9.3(D) ; off-sheet HEATER_B_3
HEATER_B_4: D12#2.2(A) J7.8 Q10.3(D) ; off-sheet HEATER_B_4
HEATER_B_5: D6.2(A) J8.2 Q4.3(D) ; off-sheet HEATER_B_5
HEATER_B_6: D10.2(A) J8.4 Q8.3(D) ; off-sheet HEATER_B_6
HEATER_B_7: D7.2(A) J8.6 Q5.3(D) ; off-sheet HEATER_B_7
HEATER_B_8: D8.2(A) J8.8 Q6.3(D) ; off-sheet HEATER_B_8
HEATER_PWM_1: R152#2.1 ; off-sheet HEATER_PWM_1
HEATER_PWM_2: R159#2.1 ; off-sheet HEATER_PWM_2
HEATER_PWM_3: R164#2.1 ; off-sheet HEATER_PWM_3
HEATER_PWM_4: R166#2.1 ; off-sheet HEATER_PWM_4
HEATER_PWM_5: R153#2.1 ; off-sheet HEATER_PWM_5
HEATER_PWM_6: R160#2.1 ; off-sheet HEATER_PWM_6
HEATER_PWM_7: R154#2.1 ; off-sheet HEATER_PWM_7
HEATER_PWM_8: R158#2.1 ; off-sheet HEATER_PWM_8
NetQ3_1: Q3.1(G) R152#2.2 R155#2.2
NetQ4_1: Q4.1(G) R153#2.2 R156#2.2
NetQ5_1: Q5.1(G) R154#2.2 R157#2.2
NetQ6_1: Q6.1(G) R158#2.2 R161#2.2
NetQ7_1: Q7.1(G) R159#2.2 R162#2.2
NetQ8_1: Q8.1(G) R160#2.2 R163#2.2
NetQ9_1: Q9.1(G) R164#2.2 R165#2.2
NetQ10_1: Q10.1(G) R166#2.2 R167#2.2

### Notes on the sheet
- Project:
- BEE-1012
- Sub-system:
- SATELLITE_EXP_CONTROLLER
- Design by:
- SANG HUYNH
- BAO BUI
- Sheet title:
- Sheet
- A3
- of
- Checked by:
- Approved by:
- VU PHAM
- Revision:
- Document No:
- Size:
- Date:

### Library data of the parts
C88 C89 = _CAP_C_2: CAP
D5-D11 D12#2 = Diode SMD: Default Diode; Code - JEDEC: DO-214-AB; Value: 1N5007; Published: 8-Jun-2000; Revision: July-2002: Re-released for DXP Platform.; Publisher: Altium Limited
J7 J8 = Header 8x1_2M
Q3-Q10 = MOSFET_N: N-Channel 30 V 5.7A (Ta) 1.4W (Ta) Surface Mount SOT-23-3; MF: Alpha & Omega Semiconductor; SnapEDA_Link: https://www.snapeda.com/parts/AO3400A/Alpha/view-part/?ref=snap; Package: SOT-23 Alpha &amp; Omega Semiconductor Inc.; Value: *; MP: AO3400A; Check_prices: https://www.snapeda.com/parts/AO3400A/Alpha/view-part/?ref=eda
R152#2 R153#2 R154#2 R155#2 R156#2 R157#2 R158#2 R159#2 R160#2 R161#2 R162#2 R163#2 R164#2 R165#2 R166#2 R167#2 = _RES_B_2: RES

## Sheet 16_TEC.SchDoc
size 420 x 297 mm; SheetNumber: 25; SheetTotal: 33
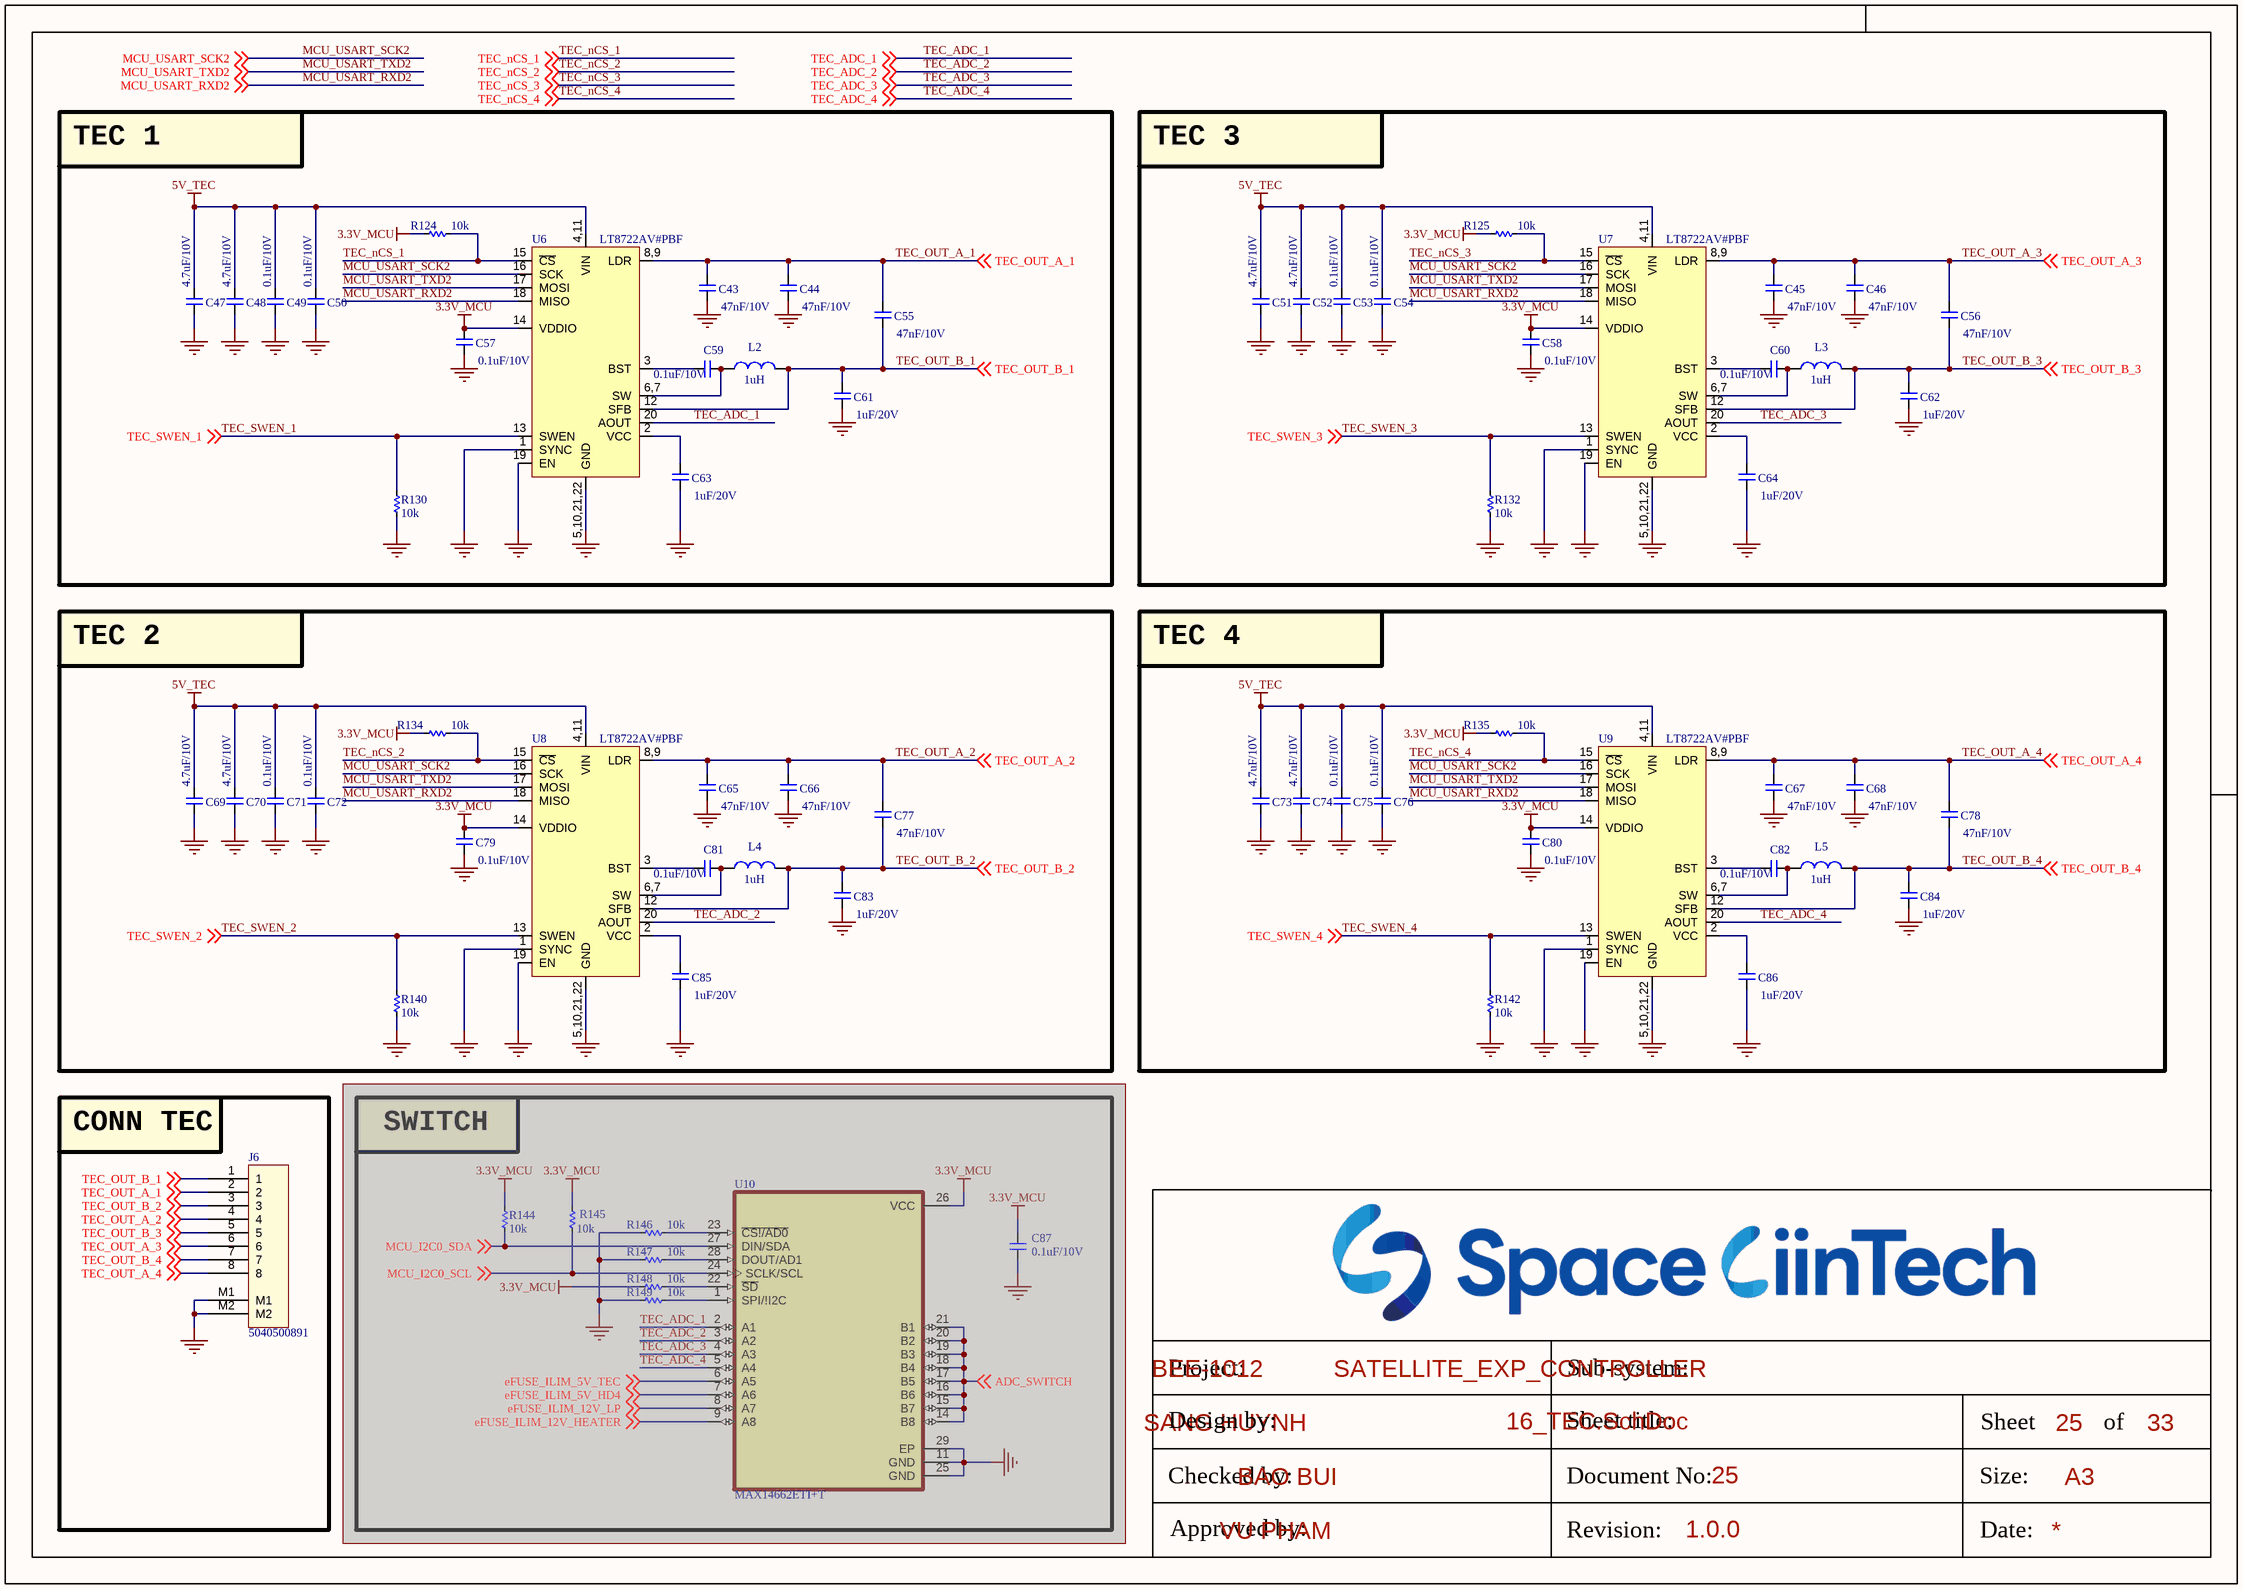
[diagram p29: 16_TEC.SchDoc]

### Parts
(Parts that share a designator on the sheet are numbered #1, #2 ... from top to bottom, then left to right.)
C43  47nF/10V  [CAP_C_1005X50_L]
C44  47nF/10V  [CAP_C_1005X50_L]
C45  47nF/10V  [CAP_C_1005X50_L]
C46  47nF/10V  [CAP_C_1005X50_L]
C47  4.7uF/10V  [CAP_C_1005X50_L]
C48  4.7uF/10V  [CAP_C_1005X50_L]
C49  0.1uF/10V  [CAP_C_1005X50_L]
C50  0.1uF/10V  [CAP_C_1005X50_L]
C51  4.7uF/10V  [CAP_C_1005X50_L]
C52  4.7uF/10V  [CAP_C_1005X50_L]
C53  0.1uF/10V  [CAP_C_1005X50_L]
C54  0.1uF/10V  [CAP_C_1005X50_L]
C55  47nF/10V  [CAP_C_1005X50_L]
C56  47nF/10V  [CAP_C_1005X50_L]
C57  0.1uF/10V  [CAP_C_1005X50_L]
C58  0.1uF/10V  [CAP_C_1005X50_L]
C59  0.1uF/10V  [CAP_C_1005X50_L]
C60  0.1uF/10V  [CAP_C_1005X50_L]
C61  1uF/20V  [CAP_C_1005X50_L]
C62  1uF/20V  [CAP_C_1005X50_L]
C63  1uF/20V  [CAP_C_1005X50_L]
C64  1uF/20V  [CAP_C_1005X50_L]
C65  47nF/10V  [CAP_C_1005X50_L]
C66  47nF/10V  [CAP_C_1005X50_L]
C67  47nF/10V  [CAP_C_1005X50_L]
C68  47nF/10V  [CAP_C_1005X50_L]
C69  4.7uF/10V  [CAP_C_1005X50_L]
C70  4.7uF/10V  [CAP_C_1005X50_L]
C71  0.1uF/10V  [CAP_C_1005X50_L]
C72  0.1uF/10V  [CAP_C_1005X50_L]
C73  4.7uF/10V  [CAP_C_1005X50_L]
C74  4.7uF/10V  [CAP_C_1005X50_L]
C75  0.1uF/10V  [CAP_C_1005X50_L]
C76  0.1uF/10V  [CAP_C_1005X50_L]
C77  47nF/10V  [CAP_C_1005X50_L]
C78  47nF/10V  [CAP_C_1005X50_L]
C79  0.1uF/10V  [CAP_C_1005X50_L]
C80  0.1uF/10V  [CAP_C_1005X50_L]
C81  0.1uF/10V  [CAP_C_1005X50_L]
C82  0.1uF/10V  [CAP_C_1005X50_L]
C83  1uF/20V  [CAP_C_1005X50_L]
C84  1uF/20V  [CAP_C_1005X50_L]
C85  1uF/20V  [CAP_C_1005X50_L]
C86  1uF/20V  [CAP_C_1005X50_L]
C87#1  0.1uF/10V  [CAP_C_1005X50_L]  (masked out: inside a compile mask, not in the netlist)
J6  5040500891  [MOLEX_5040500891]
L2  1uH  [L-SMD-M-3.5x3.5x2mm]
L3  1uH  [L-SMD-M-3.5x3.5x2mm]
L4  1uH  [L-SMD-M-3.5x3.5x2mm]
L5  1uH  [L-SMD-M-3.5x3.5x2mm]
R124  10k  [RES_C_1005x30_L]
R125  10k  [RES_C_1005x30_L]
R130  10k  [RES_C_1005x30_L]
R132  10k  [RES_C_1005x30_L]
R134  10k  [RES_C_1005x30_L]
R135  10k  [RES_C_1005x30_L]
R140  10k  [RES_C_1005x30_L]
R142  10k  [RES_C_1005x30_L]
R144#1  10k  [RES_C_1005x30_L]  (masked out: inside a compile mask, not in the netlist)
R145#1  10k  [RES_C_1005x30_L]  (masked out: inside a compile mask, not in the netlist)
R146#1  10k  [RES_C_1005x30_L]  (masked out: inside a compile mask, not in the netlist)
R147#1  10k  [RES_C_1005x30_L]  (masked out: inside a compile mask, not in the netlist)
R148#1  10k  [RES_C_1005x30_L]  (masked out: inside a compile mask, not in the netlist)
R149#1  10k  [RES_C_1005x30_L]  (masked out: inside a compile mask, not in the netlist)
U6  LT8722AV#PBF  [QFN18]
U7  LT8722AV#PBF  [QFN18]
U8  LT8722AV#PBF  [QFN18]
U9  LT8722AV#PBF  [QFN18]
U10#1  MAX14662ETI+T  [QFN40P400X400X80-29N]  (masked out: inside a compile mask, not in the netlist)

### Blocks framed on the sheet
TEC 1: C43 C44 C47-C50 C55 C57 C59 C61 C63 L2 R124 R130 U6
TEC 3: C45 C46 C51-C54 C56 C58 C60 C62 C64 L3 R125 R132 U7
TEC 2: C65 C66 C69-C72 C77 C79 C81 C83 C85 L4 R134 R140 U8
TEC 4: C67 C68 C73-C76 C78 C80 C82 C84 C86 L5 R135 R142 U9
CONN TEC: J6
SWITCH: C87#1 R144#1 R145#1 R146#1 R147#1 R148#1 R149#1 U10#1

### Nets
3.3V_MCU: C57.2 C58.2 C79.2 C80.2 R124.1 R125.1 R134.1 R135.1 U6.14(VDDIO) U7.14(VDDIO) U8.14(VDDIO) U9.14(VDDIO)
5V_TEC: C47.2 C48.2 C49.2 C50.2 C51.2 C52.2 C53.2 C54.2 C69.2 C70.2 C71.2 C72.2 C73.2 C74.2 C75.2 C76.2 U6.4,11(VIN) U7.4,11(VIN) U8.4,11(VIN) U9.4,11(VIN)
GND: C43.1 C44.1 C45.1 C46.1 C47.1 C48.1 C49.1 C50.1 C51.1 C52.1 C53.1 C54.1 C57.1 C58.1 C61.1 C62.1 C63.1 C64.1 C65.1 C66.1 C67.1 C68.1 C69.1 C70.1 C71.1 C72.1 C73.1 C74.1 C75.1 C76.1 C79.1 C80.1 C83.1 C84.1 C85.1 C86.1 J6.M1 J6.M2 R130.2 R132.2 R140.2 R142.2 U6.1(SYNC) U6.5,10,21,22(GND) U6.19(EN) U7.1(SYNC) U7.5,10,21,22(GND) U7.19(EN) U8.1(SYNC) U8.5,10,21,22(GND) U8.19(EN) U9.1(SYNC) U9.5,10,21,22(GND) U9.19(EN)
MCU_USART_RXD2: U6.18(MISO) U7.18(MISO) U8.18(MISO) U9.18(MISO) ; off-sheet MCU_USART_RXD2
MCU_USART_SCK2: U6.16(SCK) U7.16(SCK) U8.16(SCK) U9.16(SCK) ; off-sheet MCU_USART_SCK2
MCU_USART_TXD2: U6.17(MOSI) U7.17(MOSI) U8.17(MOSI) U9.17(MOSI) ; off-sheet MCU_USART_TXD2
TEC_ADC_1: U6.20(AOUT) ; off-sheet TEC_ADC_1
TEC_ADC_2: U8.20(AOUT) ; off-sheet TEC_ADC_2
TEC_ADC_3: U7.20(AOUT) ; off-sheet TEC_ADC_3
TEC_ADC_4: U9.20(AOUT) ; off-sheet TEC_ADC_4
TEC_nCS_1: R124.2 U6.15(~{CS}) ; off-sheet TEC_nCS_1
TEC_nCS_2: R134.2 U8.15(~{CS}) ; off-sheet TEC_nCS_2
TEC_nCS_3: R125.2 U7.15(~{CS}) ; off-sheet TEC_nCS_3
TEC_nCS_4: R135.2 U9.15(~{CS}) ; off-sheet TEC_nCS_4
TEC_OUT_A_1: C43.2 C44.2 C55.2 J6.2 U6.8,9(LDR) ; off-sheet TEC_OUT_A_1
TEC_OUT_A_2: C65.2 C66.2 C77.2 J6.4 U8.8,9(LDR) ; off-sheet TEC_OUT_A_2
TEC_OUT_A_3: C45.2 C46.2 C56.2 J6.6 U7.8,9(LDR) ; off-sheet TEC_OUT_A_3
TEC_OUT_A_4: C67.2 C68.2 C78.2 J6.8 U9.8,9(LDR) ; off-sheet TEC_OUT_A_4
TEC_OUT_B_1: C55.1 C61.2 J6.1 L2.2 U6.12(SFB) ; off-sheet TEC_OUT_B_1
TEC_OUT_B_2: C77.1 C83.2 J6.3 L4.2 U8.12(SFB) ; off-sheet TEC_OUT_B_2
TEC_OUT_B_3: C56.1 C62.2 J6.5 L3.2 U7.12(SFB) ; off-sheet TEC_OUT_B_3
TEC_OUT_B_4: C78.1 C84.2 J6.7 L5.2 U9.12(SFB) ; off-sheet TEC_OUT_B_4
TEC_SWEN_1: R130.1 U6.13(SWEN) ; off-sheet TEC_SWEN_1
TEC_SWEN_2: R140.1 U8.13(SWEN) ; off-sheet TEC_SWEN_2
TEC_SWEN_3: R132.1 U7.13(SWEN) ; off-sheet TEC_SWEN_3
TEC_SWEN_4: R142.1 U9.13(SWEN) ; off-sheet TEC_SWEN_4
NetC59_1: C59.1 L2.1 U6.6,7(SW)
NetC59_2: C59.2 U6.3(BST)
NetC60_1: C60.1 L3.1 U7.6,7(SW)
NetC60_2: C60.2 U7.3(BST)
NetC63_2: C63.2 U6.2(VCC)
NetC64_2: C64.2 U7.2(VCC)
NetC81_1: C81.1 L4.1 U8.6,7(SW)
NetC81_2: C81.2 U8.3(BST)
NetC82_1: C82.1 L5.1 U9.6,7(SW)
NetC82_2: C82.2 U9.3(BST)
NetC85_2: C85.2 U8.2(VCC)
NetC86_2: C86.2 U9.2(VCC)

### Notes on the sheet
- Project:
- BEE-1012
- Sub-system:
- SATELLITE_EXP_CONTROLLER
- Design by:
- SANG HUYNH
- BAO BUI
- Sheet title:
- Sheet
- A3
- of
- Checked by:
- Approved by:
- VU PHAM
- Revision:
- Document No:
- Size:
- Date:

### Library data of the parts
C43-C86 C87#1 = _CAP_C_2: CAP
J6 = Header 8x1_2M
L2-L5 = L-SMD-1: partNo: 78477010; Manufacturer: Wurth Elektronik; Inductance: 1.0 μH; ComponentLink1Description: Manufacturer; ComponentLink1URL: http://www.we-online.de; Created by: Baojun Chen; Created Date: Nov.2015; ComponentLink2Description: Datasheet; ComponentLink2URL: http://katalog.we-online.de/pbs/datasheet/78477010.pdf
R124 R125 R130 R132 R134 R135 R140 R142 R144#1 R145#1 R146#1 R147#1 R148#1 R149#1 = _RES_B_2: RES
U6-U9 = LT8722
U10#1 = IC_SW_MAX14662ETI+T: 8 Circuit IC Switch 1:1 1Ohm 28-TQFN _4x4_; MF: Maxim Integrated; Package: TQFN-28 Maxim; Value: *; Price: None; MP: MAX14662ETI+T; SnapEDA_Link: https://www.snapeda.com/parts/MAX14662ETI%2BT/Maxim%20Integrated/view-part/546683/?ref=snap; Availability: Unavailable